# EAGLE board stm32 v0.8 (EAGLE 9.6.1), part 1 of 2
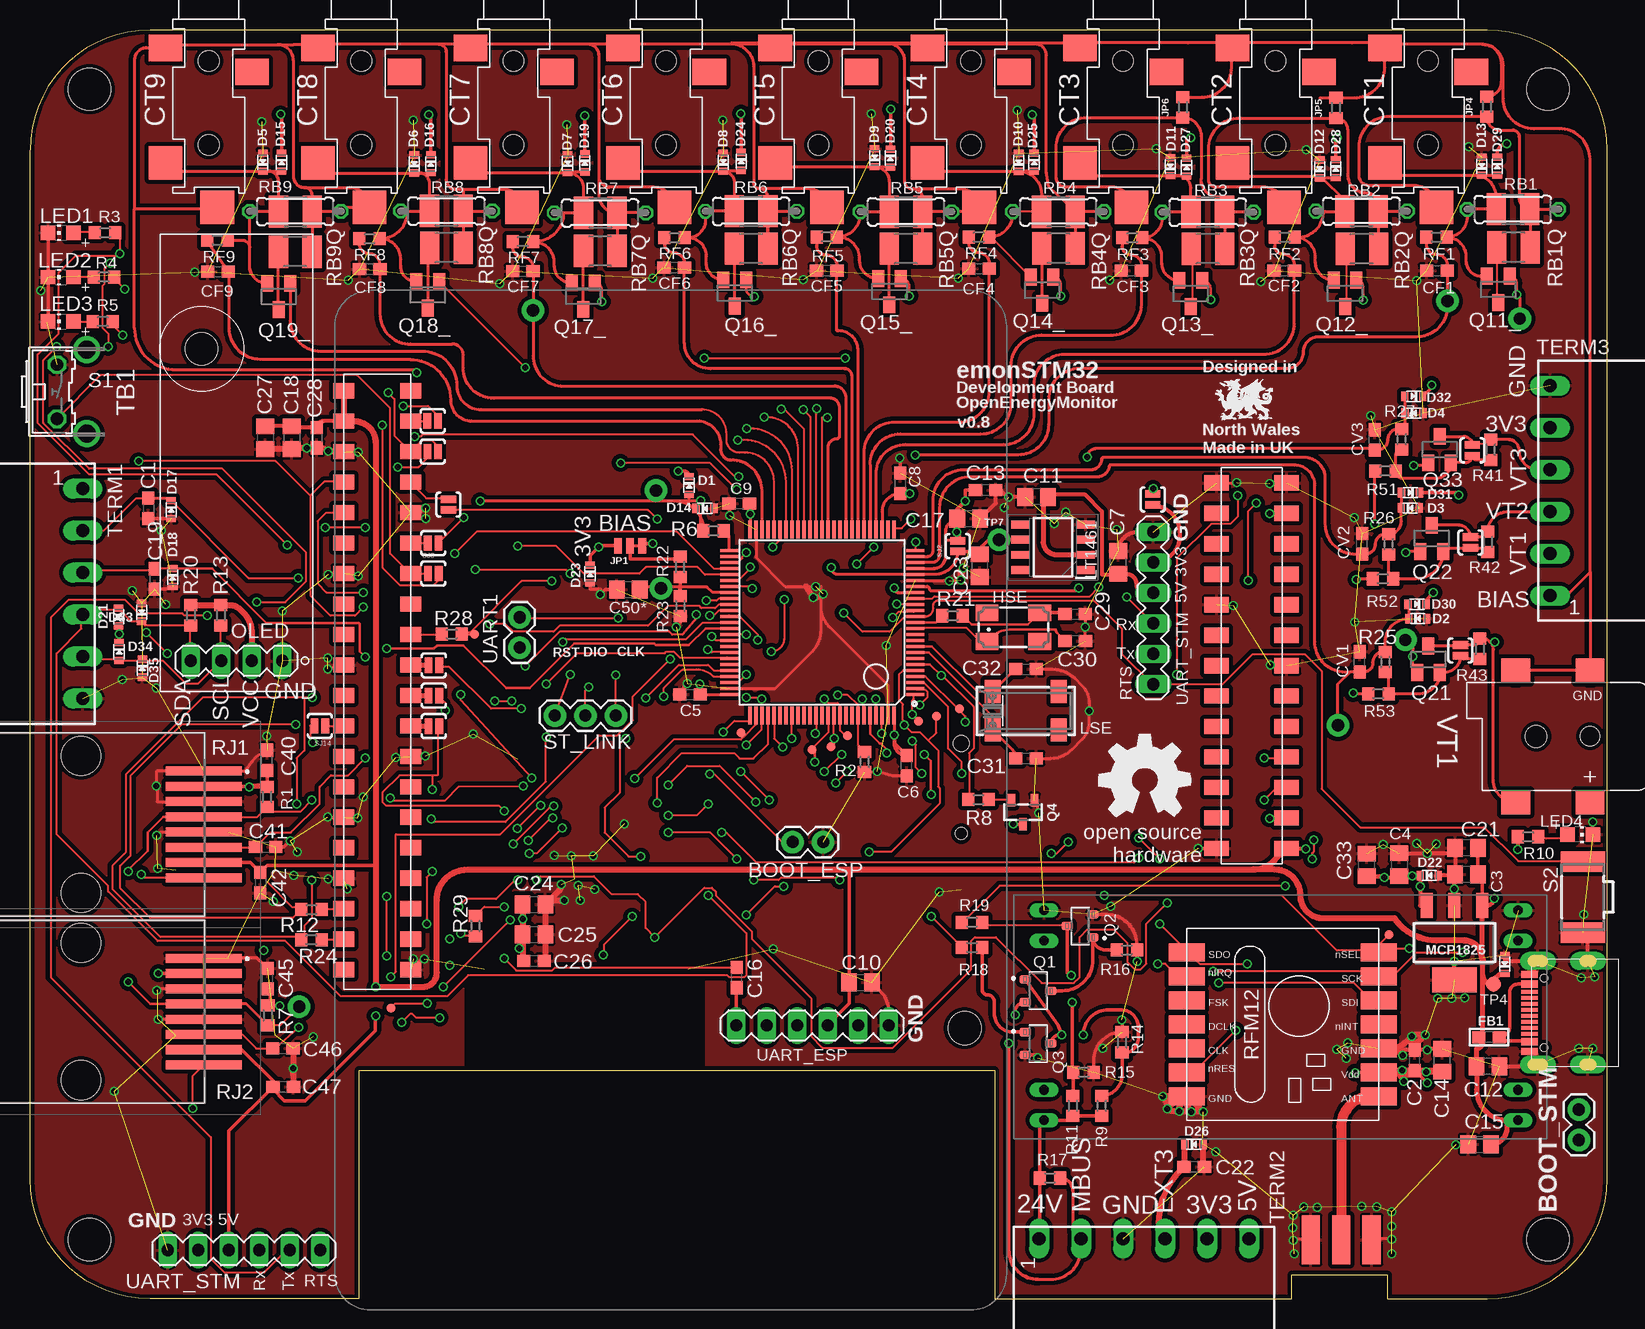
[diagram p5: board, top side]
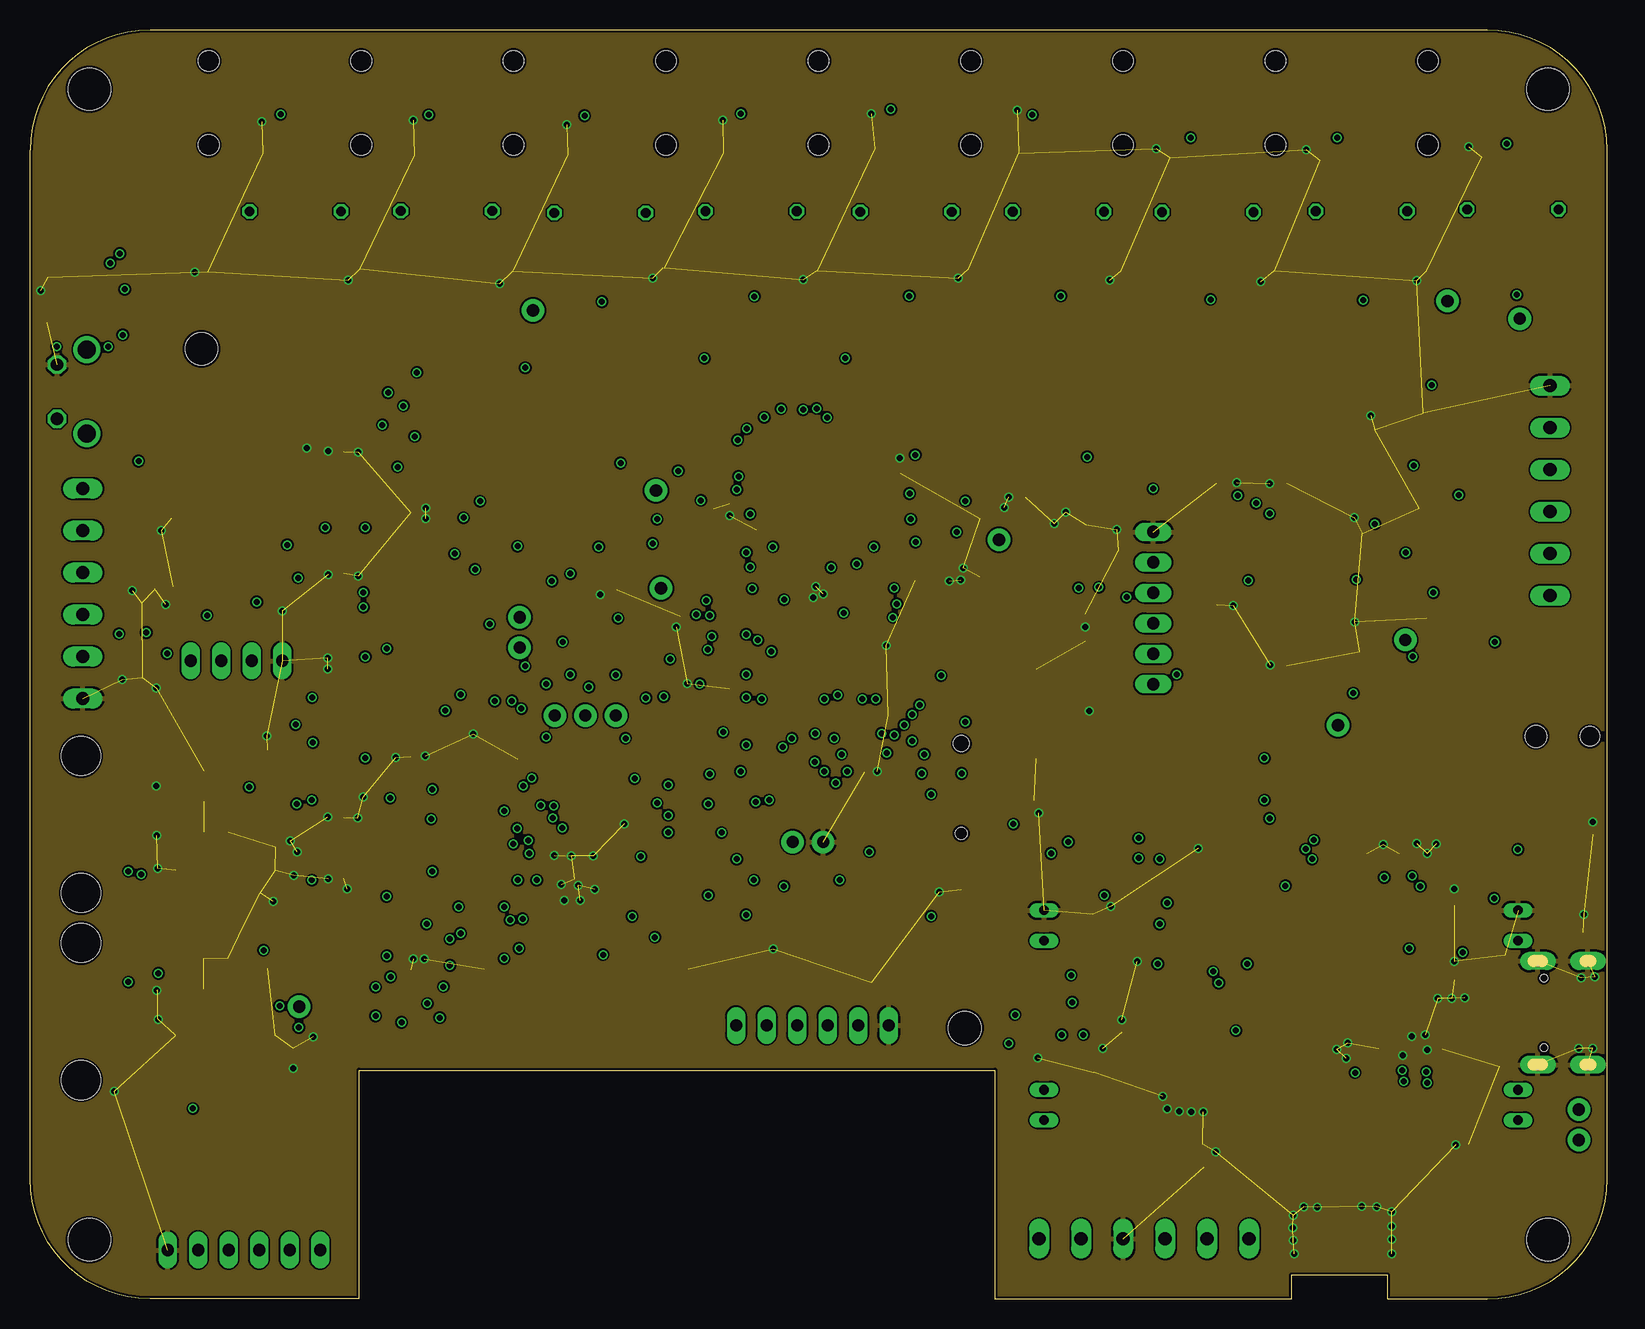
[diagram p6: board, inner layer GND]
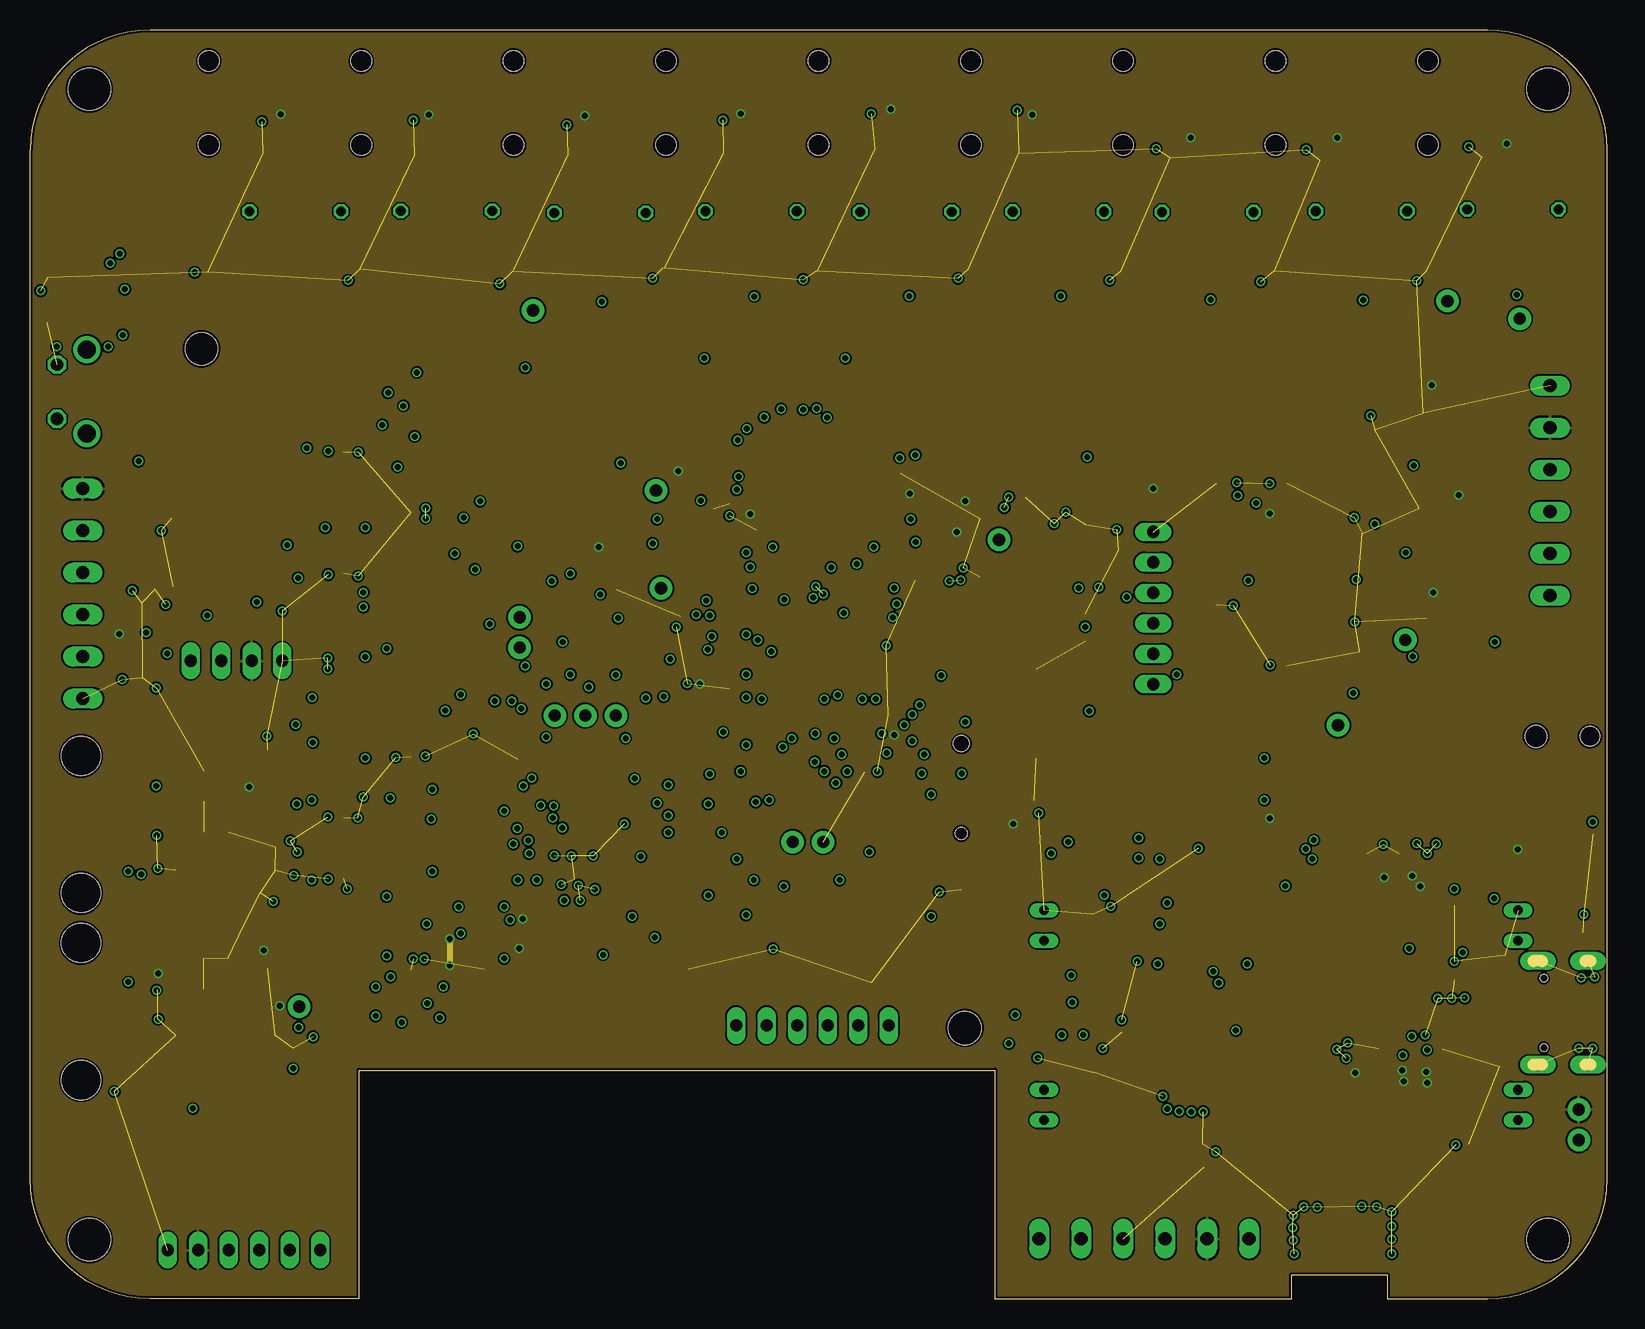
[diagram p7: board, inner layer +3V3]
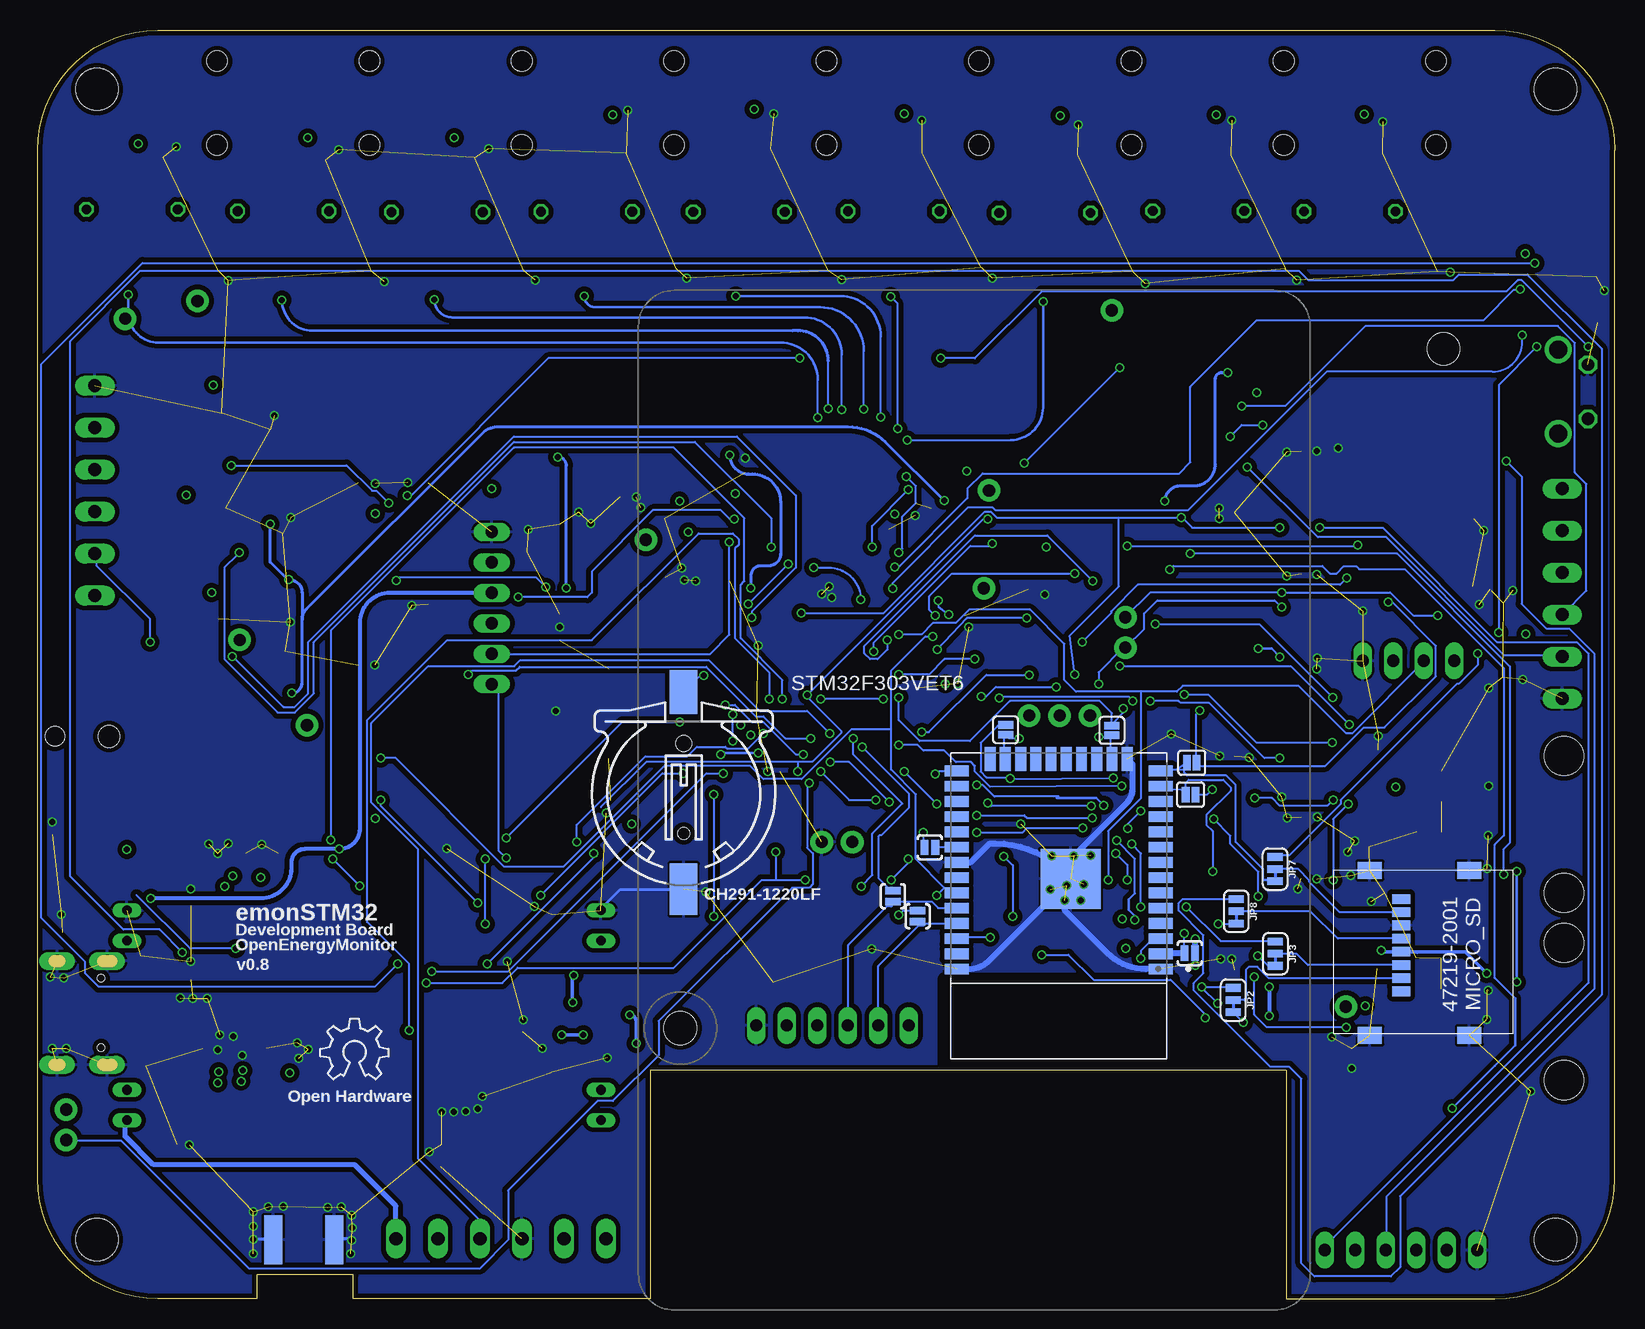
[diagram p8: board, bottom side, seen from below]

Size 131.44 x 105.79 mm. Coordinates in mm from the lower left corner, seen from the top.
Outline: 131.44,10 131.44,95.79 arc90 121.44,105.79 10,105.79 arc90 0,95.79 0,10 arc90 10,0 27.4,0 27.4,19.07 80.41,19.07 80.41,0 105.14,0 105.14,2 113.14,2 113.14,0 121.44,0 arc90 131.44,10
Copper layers (1+2*15+16): Top 0.035mm / dielectric 0.2mm / GND 0.018mm / dielectric 1.1mm / +3V3 0.018mm / dielectric 0.2mm / Bottom 0.035mm
Design rules "ragworm *": minimum track width 7mil, minimum drill 0.5mm, track to track 6mil, track to pad 6mil, pad to pad 7mil, via to via 8mil, smd to smd 0mil, copper to edge 8mil, drill to drill 10mil, minimum pad ring 3mil, minimum via ring 3mil, stop-mask expansion 2mil, vias tented up to drill 25mil, thermal gap 8mil
Net classes: 0 default: width 0.178 mm, drill 0.5 mm, clearance 0.152 mm; 1 power: width 0.254 mm, drill 0.5 mm, clearance 0.152 mm; 2 gnd: width 0.254 mm, drill 0.5 mm, clearance 0.152 mm; 3 ant: width 0.406 mm, drill 0.5 mm, clearance 0.254 mm; 4 cts_vts: width 0.254 mm, drill 0.5 mm, clearance 0.229 mm
Holes 3.5 mm at 126.5,100.85 4.95,100.85 4.95,4.95 126.5,4.95
Holes 2.7 mm at 14.3,79.2
tRestrict: area 36.6,18.4 to 55.9,26.8
bRestrict: area 36.7,18.4 to 56,26.8

## Footprints (pad centres in the part's own frame; a part is rotated, then mirrored left to right if it is on the bottom)
1X02 = drill 1.016 pad 1.88: 1 0,0; 2 2.54,0
C0603 = smd 1.1 x 1: 1 -0.85,0; 2 0.85,0
C0805 = smd 1.3 x 1.5: 1 -0.95,0; 2 0.95,0
STEREO_SMT = smd 2.8 x 2.2: P$1 -3.6,-2.4; P$3 3.6,-4.4 | smd 2.8 x 2.8: P$2 -3.6,-12; P$4 0.7,-15.7 | hole 1.7: 0,-3.5; 0,-10.5
SOD-523 = smd 0.8 x 0.6: A 0,-0.75; K 0,0.75
2X13_SMT = smd 1.27 x 2.032: 1 -15.24,-2.921; 2 -15.24,2.921; 3 -12.7,-2.921; 4 -12.7,2.921; 5 -10.16,-2.921; 6 -10.16,2.921; 7 -7.62,-2.921; 8 -7.62,2.921; 9 -5.08,-2.921; 10 -5.08,2.921; 11 -2.54,-2.921; 12 -2.54,2.921; 13 0,-2.921; 14 0,2.921; 15 2.54,-2.921; 16 2.54,2.921; 17 5.08,-2.921; 18 5.08,2.921; 19 7.62,-2.921; 20 7.62,2.921; 21 10.16,-2.921; 22 10.16,2.921; 23 12.7,-2.921; 24 12.7,2.921; 25 15.24,-2.921; 26 15.24,2.921
0603 = smd 1.1 x 1: 1 -0.85,0; 2 0.85,0
CH291-1220LF = smd 2.3 x 3.66: + 0,-2.296 | smd 2.3 x 4.3: - 0,14.146 | hole 1.3: 0,2 | hole 1: 0,9.5
CTS406 = smd 1.9 x 1.4: 1 -2.2,-1.2; 2 2.2,-1.2; 3 2.2,1.2; 4 -2.2,1.2
SJ_2S-NO = smd 0.635 x 1.27: 1 -0.45,0; 2 0.45,0
SMA-EDGE = smd 1.524 x 4.064: GND@0 0,0; GND@1 5.08,0; SIG 2.54,0 | smd 1.524 x 4.064 bottom: GND@2 0,0; GND@3 5.08,0
SMT-JUMPER_3_1-NC_TRACE_NO-SILK = smd 0.635 x 1.27: 1 -1.016,0; 2 0,0; 3 1.016,0
SMT-JUMPER_3_1-NC_TRACE_SILK = smd 0.635 x 1.27: 1 -1.016,0; 2 0,0; 3 1.016,0
R0603 = smd 1 x 1.1: 1 -0.85,0; 2 0.85,0
CHIP-LED0805 = smd 1.2 x 1.2: A 0,-1.05; C 0,1.05
CRYSTAL_8X3.8 = smd 1.3 x 1.9: P$1 -2.75,-1.6; P$2 2.75,-1.6; P$3 2.75,1.6; P$4 -2.75,1.6
SOT-223 = smd 1 x 2.1: 1 -2.3,-3.1; 2 0,-3.1; 3 2.3,-3.1 | smd 3.7 x 2.1: 4 0,3.1
MA04-1-OLED = drill 1.016 long: 1 -3.81,0; 2 -1.27,0; 3 1.27,0; 4 3.81,0
RPI3MIRROR2 = smd 1.27 x 1.778: P$41 8.371,6.351; P$42 8.371,0.763; P$43 10.911,6.351; P$44 10.911,0.763; P$45 13.451,6.351; P$46 13.451,0.763; P$47 15.991,6.351; P$48 15.991,0.763; P$49 18.531,6.351; P$50 18.531,0.763; P$51 21.071,6.351; P$52 21.071,0.763; P$53 23.611,6.351; P$54 23.611,0.763; P$55 26.151,6.351; P$56 26.151,0.763; P$57 28.691,6.351; P$58 28.691,0.763; P$59 31.231,6.351; P$60 31.231,0.763; P$61 33.771,6.351; P$62 33.771,0.763; P$63 36.311,6.351; P$64 36.311,0.763; P$65 38.851,6.351; P$66 38.851,0.763; P$67 41.391,6.351; P$68 41.391,0.763; P$69 43.931,6.351; P$70 43.931,0.763; P$71 46.471,6.351; P$72 46.471,0.763; P$73 49.011,6.351; P$74 49.011,0.763; P$75 51.551,6.351; P$76 51.551,0.763; P$77 54.091,6.351; P$78 54.091,0.763; P$79 56.631,6.351; P$80 56.631,0.763 | hole 2.75: 61.5,52.505
SOIC127P599X175-8N = smd 1.526 x 0.65: 1 -2.712,1.905; 2 -2.712,0.635; 3 -2.712,-0.635; 4 -2.712,-1.905; 5 2.712,-1.905; 6 2.712,-0.635; 7 2.712,0.635; 8 2.712,1.905
SOT23 = smd 0.71 x 0.96: 1 -0.95,-1.075; 2 0.95,-1.075; 3 0,1.075
SOT23-R = smd 0.635 x 1.016: 1 -0.95,-1; 2 0.95,-1; 3 0,1
SOT23' = smd 1 x 1.4: 1 -0.95,-1.1; 2 0.95,-1.1; 3 0,1.1
R1210 = smd 1.6 x 2.7: 1 -1.4,0; 2 1.4,0
0207/7 = drill 0.813 octagon: 1 -3.81,0; 2 3.81,0
RFM12 = smd 1.5 x 3: 1 -5,-10; 2 -3,-10; 3 -1,-10; 4 1,-10; 5 3,-10; 6 5,-10; 7 7,-10; 8 7,6; 9 5,6; 10 3,6; 11 1,6; 12 -1,6; 13 -3,6; 14 -5,6
955016889 = smd 0.76 x 6.35: 1 -4.445,8.975; 2 -3.175,8.975; 3 -1.905,8.975; 4 -0.635,8.975; 5 0.635,8.975; 6 1.905,8.975; 7 3.175,8.975; 8 4.445,8.975 | hole 3.25: -5.715,-1.25; 5.715,-1.25
B3F-31XX = drill 1.016 octagon: 1 -2.261,-1.245; 2 2.261,-1.245 | drill 1.499 pad 2.159: 3 -3.505,1.245; 4 3.505,1.245
KSS = smd 1.7 x 3.7: 1 -2.95,0; 2 2.95,0
SMT-JUMPER_2_NO_SILK = smd 0.635 x 1.27: 1 -0.406,0; 2 0.406,0
1X03 = drill 1.016 pad 1.88: 1 0,0; 2 2.54,0; 3 5.08,0
TQFP100 = smd 0.27 x 1.5: 1 -6,-7.75; 2 -5.5,-7.75; 3 -5,-7.75; 4 -4.5,-7.75; 5 -4,-7.75; 6 -3.5,-7.75; 7 -3,-7.75; 8 -2.5,-7.75; 9 -2,-7.75; 10 -1.5,-7.75; 11 -1,-7.75; 12 -0.5,-7.75; 13 0,-7.75; 14 0.5,-7.75; 15 1,-7.75; 16 1.5,-7.75; 17 2,-7.75; 18 2.5,-7.75; 19 3,-7.75; 20 3.5,-7.75; 21 4,-7.75; 22 4.5,-7.75; 23 5,-7.75; 24 5.5,-7.75; 25 6,-7.75; 51 6,7.75; 52 5.5,7.75; 53 5,7.75; 54 4.5,7.75; 55 4,7.75; 56 3.5,7.75; 57 3,7.75; 58 2.5,7.75; 59 2,7.75; 60 1.5,7.75; 61 1,7.75; 62 0.5,7.75; 63 0,7.75; 64 -0.5,7.75; 65 -1,7.75; 66 -1.5,7.75; 67 -2,7.75; 68 -2.5,7.75; 69 -3,7.75; 70 -3.5,7.75; 71 -4,7.75; 72 -4.5,7.75; 73 -5,7.75; 74 -5.5,7.75; 75 -6,7.75 | smd 1.5 x 0.27: 26 7.75,-6; 27 7.75,-5.5; 28 7.75,-5; 29 7.75,-4.5; 30 7.75,-4; 31 7.75,-3.5; 32 7.75,-3; 33 7.75,-2.5; 34 7.75,-2; 35 7.75,-1.5; 36 7.75,-1; 37 7.75,-0.5; 38 7.75,0; 39 7.75,0.5; 40 7.75,1; 41 7.75,1.5; 42 7.75,2; 43 7.75,2.5; 44 7.75,3; 45 7.75,3.5; 46 7.75,4; 47 7.75,4.5; 48 7.75,5; 49 7.75,5.5; 50 7.75,6; 76 -7.75,6; 77 -7.75,5.5; 78 -7.75,5; 79 -7.75,4.5; 80 -7.75,4; 81 -7.75,3.5; 82 -7.75,3; 83 -7.75,2.5; 84 -7.75,2; 85 -7.75,1.5; 86 -7.75,1; 87 -7.75,0.5; 88 -7.75,0; 89 -7.75,-0.5; 90 -7.75,-1; 91 -7.75,-1.5; 92 -7.75,-2; 93 -7.75,-2.5; 94 -7.75,-3; 95 -7.75,-3.5; 96 -7.75,-4; 97 -7.75,-4.5; 98 -7.75,-5; 99 -7.75,-5.5; 100 -7.75,-6
MA06-1 = drill 1.016 long: 1 -6.35,0; 2 -3.81,0; 3 -1.27,0; 4 1.27,0; 5 3.81,0; 6 6.35,0
3.5MM_X6 = drill 1.1 long: P$1 3,8.75; P$2 3,5.25; P$3 3,1.75; P$4 3,-1.75; P$5 3,-5.25; P$6 3,-8.75
PAD.03X.03 = smd 0.762 x 0.762: P$1 0,0
B1,27 = smd 1.27 x 1.27: TP 0,0
1X01_NO_SILK = drill 1.016 pad 1.88: 1 0,0
MODULE_ESP32-WROOM-32D = smd 2 x 0.9: 1 -8.5,5.26; 2 -8.5,3.99; 3 -8.5,2.72; 4 -8.5,1.45; 5 -8.5,0.18; 6 -8.5,-1.09; 7 -8.5,-2.36; 8 -8.5,-3.63; 9 -8.5,-4.9; 10 -8.5,-6.17; 11 -8.5,-7.44; 12 -8.5,-8.71; 13 -8.5,-9.98; 14 -8.5,-11.25; 25 8.5,-11.25; 26 8.5,-9.98; 27 8.5,-8.71; 28 8.5,-7.44; 29 8.5,-6.17; 30 8.5,-4.9; 31 8.5,-3.63; 32 8.5,-2.36; 33 8.5,-1.09; 34 8.5,0.18; 35 8.5,1.45; 36 8.5,2.72; 37 8.5,3.99; 38 8.5,5.26 | smd 0.9 x 2: 15 -5.715,-12.25; 16 -4.445,-12.25; 17 -3.175,-12.25; 18 -1.905,-12.25; 19 -0.635,-12.25; 20 0.635,-12.25; 21 1.905,-12.25; 22 3.175,-12.25; 23 4.445,-12.25; 24 5.715,-12.25 | smd 5 x 5: 39 -1,-2.24
BOOST = drill 0.8 long: IN+ 17.5,39.5; IN+1 14.96,39.5; OUT+ 17.5,0; OUT+1 14.96,0; P$1 0,0; P$2 0,39.5; P$3 2.54,39.5; P$4 2.54,0
47219-2001_MICROSD = smd 1.45 x 2: P$1 0,0; P$2 13.75,0; P$3 0,8.3; P$4 13.75,8.3 | smd 0.8 x 1.5: PIN1 10.08,2.6; PIN2 8.98,2.6; PIN3 7.88,2.6; PIN4 6.78,2.6; PIN5 5.68,2.6; PIN6 4.58,2.6; PIN7 3.48,2.6; PIN8 2.38,2.6
USB-C = smd 0.6 x 1.4: A1/B12 -3.2,0.7; A4/B9 -2.4,0.7; B1/A12 3.2,0.7; B4/A9 2.4,0.7 | smd 0.3 x 1.4: A5 -1.25,0.7; A6 -0.25,0.7; A7 0.25,0.7; A8 1.25,0.7; B5 1.75,0.7; B6 0.75,0.7; B7 -0.75,0.7; B8 -1.75,0.7 | drill 1 pad 1.2 long: GND1 -4.32,0; GND2 4.33,0; GND3 4.33,-4.18; GND4 -4.32,-4.18 | hole 0.6: -2.89,-0.5; 2.89,-0.5
DCJACK_2MM_SMT = smd 2.4 x 2: GND 0,-5.5; GNDBREAK 6.2,-5.5; PWR1 0,5.5; PWR2 6.2,5.5 | hole 1.6: 0,0 | hole 1.8: 4.5,0

## Placement (x,y rotation side)
BOOT_ESP  [1X02]  66.1,38.1 180 top
BOOT_STM  [1X02]  129.07,13.25 90 top
C1  100nF  [C0603]  9.87,65.91 270 top
C2  100nF  [C0603]  115.4,19.9 90 top
C3  2.2uF  [C0805]  119.7,35.4 180 top
C4  2.2uF  [C0805]  114.1,36.2 270 top
C5  100nF  [C0603]  55,50.4 0 top
C6  100nF  [C0603]  73.05,44.46 90 top
C7  2.2uF  [C0805]  90.7,61.4 90 top
C8  100nF  [C0603]  72.5,68 270 top
C9  100nF  [C0603]  59.1,66.33 0 top
C10  2.2uF  [C0805]  69.2,26.4 0 top
C11  2.2uF  [C0805]  83.89,66.87 180 top
C12  47uF  [C0805]  121.5,19.4 180 top
C13  100nF  [C0603]  79.63,67.45 0 top
C14  2.2uF  [C0805]  117.7,19.9 90 top
C15  2.2uF  [C0805]  120.8,12.9 0 top
C16  100nF  [C0603]  58.9,26.8 90 top
C17  2.2uF  [C0805]  78.22,65.06 0 top
C18  2.2uF  [C0805]  21.8,71.8 270 top
C19  100nF  [C0603]  10.41,60.03 270 top
C21  47uF  [C0805]  119.7,37.6 180 top
C22  100nF  [C0603]  97.02,11.03 0 top
C23  2.2uF  [C0805]  79.13,61.14 270 top
C24  2.2uF  [C0805]  42,32.9 0 top
C25  2.2uF  [C0805]  42,30.4 0 top
C26  100nF  [C0603]  42,28.2 0 top
C27  2.2uF  [C0805]  19.6,71.8 270 top
C28  100nF  [C0603]  23.9,71.8 270 top
C29  15pF  [C0603]  87.09,57.09 0 top
C30  15pF  [C0603]  87.1,54.86 0 top
C31  10pF  [C0603]  83,45.08 0 top
C32  10pF  [C0603]  83,52.5 0 top
C33  47uF  [C0805]  111.4,36.19 90 top
C40  100nF  [C0603]  19.75,44.9 90 top
C41  100nF  [C0603]  19.64,37.67 0 top
C42  100nF  [C0603]  19.2,34.7 270 top
C45  100nF  [C0603]  19.8,26.7 90 top
C46  100nF  [C0603]  21.07,20.89 0 top
C47  100nF  [C0603]  21.1,17.7 0 top
C50*  2.2uF  [C0805]  49.86,59.16 0 top
CF1  10nF  [C0603]  117.25,85.72 0 top
CF2  10nF  [C0603]  104.52,85.73 0 top
CF3  10nF  [C0603]  91.78,85.75 0 top
CF4  10nF  [C0603]  79.09,85.88 0 top
CF5  10nF  [C0603]  66.4,85.74 0 top
CF6  10nF  [C0603]  53.68,85.99 0 top
CF7  10nF  [C0603]  41.07,85.67 0 top
CF8  10nF  [C0603]  28.31,85.86 0 top
CF9  10nF  [C0603]  15.67,85.64 0 top
CT1  SJ-3523-SMT  [STEREO_SMT]  116.5,106.7 0 top
CT2  SJ-3523-SMT  [STEREO_SMT]  103.8,106.7 0 top
CT3  SJ-3523-SMT  [STEREO_SMT]  91.1,106.7 0 top
CT4  SJ-3523-SMT  [STEREO_SMT]  78.4,106.7 0 top
CT5  SJ-3523-SMT  [STEREO_SMT]  65.7,106.7 0 top
CT6  SJ-3523-SMT  [STEREO_SMT]  53,106.7 0 top
CT7  SJ-3523-SMT  [STEREO_SMT]  40.3,106.7 0 top
CT8  SJ-3523-SMT  [STEREO_SMT]  27.6,106.7 0 top
CT9  SJ-3523-SMT  [STEREO_SMT]  14.9,106.7 0 top
CV1  10nF  [C0603]  110.8,53.12 90 top
CV2  10nF  [C0603]  111,62.95 90 top
CV3  10nF  [C0603]  112.05,71.61 90 top
D1  ESD5Z3.3T1G  [SOD-523]  54.92,67.82 0 top
D2  ESD5Z3.3T1G  [SOD-523]  115.65,56.72 90 top
D3  ESD5Z3.3T1G  [SOD-523]  115.02,65.94 90 top
D4  ESD5Z3.3T1G  [SOD-523]  115.34,73.85 90 top
D5  ESD5Z3.3T1G  [SOD-523]  19.41,94.77 180 top
D6  ESD5Z3.3T1G  [SOD-523]  32.02,94.62 180 top
D7  ESD5Z3.3T1G  [SOD-523]  44.79,94.66 180 top
D8  ESD5Z3.3T1G  [SOD-523]  57.76,94.76 180 top
D9  ESD5Z3.3T1G  [SOD-523]  70.39,95.14 180 top
D10  ESD5Z3.3T1G  [SOD-523]  82.39,94.76 180 top
D11  ESD5Z3.3T1G  [SOD-523]  95.03,94.39 180 top
D12  ESD5Z3.3T1G  [SOD-523]  107.48,94.21 180 top
D13  ESD5Z3.3T1G  [SOD-523]  120.98,94.42 180 top
D14  ESD5Z3.3T1G  [SOD-523]  56.25,65.91 90 top
D15  ESD5Z3.3T1G  [SOD-523]  20.96,94.76 0 top
D16  ESD5Z3.3T1G  [SOD-523]  33.4,94.64 0 top
D17  ESD5Z3.3T1G  [SOD-523]  11.76,65.8 0 top
D18  ESD5Z3.3T1G  [SOD-523]  11.9,60.15 0 top
D19  ESD5Z3.3T1G  [SOD-523]  46.24,94.71 0 top
D20  ESD5Z3.3T1G  [SOD-523]  71.7,95.11 0 top
D21  ESD5Z3.3T1G  [SOD-523]  7.38,56.87 180 top
D22  ESD5Z3.3T1G  [SOD-523]  116.6,35.3 90 top
D23  ESD5Z3.3T1G  [SOD-523]  46.67,60.45 0 top
D24  ESD5Z3.3T1G  [SOD-523]  59.26,94.83 0 top
D25  ESD5Z3.3T1G  [SOD-523]  83.67,94.76 0 top
D26  ESD5Z3.3T1G  [SOD-523]  97,12.88 90 top
D27  ESD5Z3.3T1G  [SOD-523]  96.38,94.35 0 top
D28  ESD5Z3.3T1G  [SOD-523]  108.81,94.23 0 top
D29  ESD5Z3.3T1G  [SOD-523]  122.27,94.43 0 top
D30  ESD5Z3.3T1G  [SOD-523]  115.59,57.92 270 top
D31  ESD5Z3.3T1G  [SOD-523]  115.04,67.23 270 top
D32  ESD5Z3.3T1G  [SOD-523]  115.32,75.25 270 top
D33  ESD5Z3.3T1G  [SOD-523]  9.3,57.26 180 top
D34  ESD5Z3.3T1G  [SOD-523]  7.42,53.97 0 top
D35  ESD5Z3.3T1G  [SOD-523]  9.37,52.58 0 top
D40*1  ESD5Z5.0T1G  [SOD-523]  122.9,27.9 180 top
EXPANSION  TSM-113-01-T-DV  [2X13_SMT]  101.8,52.8 270 top
FB1  [0603]  121.58,21.83 180 top
G1  CH291-1220LF  [CH291-1220LF]  77.61,48.3 180 bottom
GOLD_ORB_SM1  OSHWLOGOLOGO8MM  [OSHW_8MM]  92.87,43.24 0 top
HSE  406C35E08M00000  [CTS406]  81.95,56.01 0 top
J1  SOLDERJUMPERNO  [SJ_2S-NO]  34.87,66.23 90 top
J$1  SMA_EDGE  [SMA-EDGE]  106.72,4.93 0 top
JP1  JUMPER-SMT_3_1-NC_TRACE_NO-SILK  [SMT-JUMPER_3_1-NC_TRACE_NO-SILK]  50,62.8 0 top
JP2  JUMPER-SMT_3_1-NC_TRACE_SILK  [SMT-JUMPER_3_1-NC_TRACE_SILK]  31.82,24.92 270 bottom
JP3  JUMPER-SMT_3_1-NC_TRACE_SILK  [SMT-JUMPER_3_1-NC_TRACE_SILK]  28.3,28.78 270 bottom
JP4  [R0603]  121.4,99.4 90 top
JP5  [R0603]  108.83,99.3 90 top
JP6  [R0603]  96.07,99.34 90 top
JP7  JUMPER-SMT_3_1-NC_TRACE_SILK  [SMT-JUMPER_3_1-NC_TRACE_SILK]  28.32,35.84 270 bottom
JP8  JUMPER-SMT_3_1-NC_TRACE_SILK  [SMT-JUMPER_3_1-NC_TRACE_SILK]  31.56,32.32 270 bottom
LED1  Green 1.85V  [CHIP-LED0805]  2.56,88.89 90 top
LED2  Orange 1.85V  [CHIP-LED0805]  2.56,85.19 90 top
LED3  Red 1.85V  [CHIP-LED0805]  2.56,81.49 90 top
LED4  Green 1.85V  [CHIP-LED0805]  129.19,38.71 270 top
LOGO1  OSHW_LOGO_6MILX0200-NT  [OSHW_6X200_NOTEXT]  107.87,18.31 0 bottom
LSE  32.768kHz  [CRYSTAL_8X3.8]  82.98,49.04 0 top
MCP1825  MCP1825SOT-223-3  [SOT-223]  118.7,29.7 180 top
OLED  [MA04-1-OLED]  17.2,53.2 0 top
PCB2  RPI3YA  [RPI3MIRROR2]  25.38,84.09 270 top
PS1  LT1461AIS8-3.3#PBF  [SOIC127P599X175-8N]  85.25,62.67 180 top
Q1  MMBT3906  [SOT23]  84,25.7 270 top
Q2  MMBT3904  [SOT23]  87.5,31.1 90 top
Q3  MMBT3904  [SOT23]  84,21.3 270 top
Q4  [SOT23-R]  82.75,40.58 180 top
Q11_  [SOT23']  122.35,84.17 180 top
Q12_  [SOT23']  109.59,83.83 180 top
Q13_  [SOT23']  96.72,83.82 180 top
Q14_  [SOT23']  84.34,84.1 180 top
Q15_  [SOT23']  71.62,83.97 180 top
Q16_  [SOT23']  58.73,83.86 180 top
Q17_  [SOT23']  46.1,83.6 180 top
Q18_  [SOT23']  33.15,83.71 180 top
Q19_  [SOT23']  20.72,83.57 180 top
Q21  [SOT23']  116.54,53.32 0 top
Q22  [SOT23']  116.81,63.4 0 top
Q33  [SOT23']  117.47,70.81 0 top
R1  4.7k  [R0603]  19.75,41.85 90 top
R2  10k  [R0603]  69.55,44.77 270 top
R3  330R  [R0603]  6.26,88.89 0 top
R4  330R  [R0603]  6.16,85.19 0 top
R5  330R  [R0603]  6.06,81.49 0 top
R6  0R  [R0603]  56.96,64.05 0 top
R7  4.7k  [R0603]  19.83,23.65 90 top
R8  1.5k  [R0603]  79.04,41.64 180 top
R9  39K  [R0603]  89.3,16.1 270 top
R10  330R  [R0603]  124.84,38.54 180 top
R11  33K  [R0603]  86.9,16.1 270 top
R12  10K  [R0603]  23.46,32.48 180 top
R13  10k  [R0603]  15.9,57 270 top
R14  22K  [R0603]  91,21.4 270 top
R15  3k3  [R0603]  87.8,18.9 180 top
R16  82R  [R0603]  91.4,29.1 180 top
R17  220K  [R0603]  85,10.08 180 top
R18  1k  [R0603]  78.5,29.3 180 top
R19  1k  [R0603]  78.5,31.4 180 top
R20  10k  [R0603]  13.4,57 270 top
R21  0R  [R0603]  76.88,56.96 0 top
R22  10k  [R0603]  54.18,61.03 90 top
R23  10k  [R0603]  54.2,57.77 90 top
R24  10K  [R0603]  23.45,29.95 180 top
R25  1k  [R0603]  112.95,53.1 90 top
R26  1k  [R0603]  113.22,62.92 90 top
R27  1k  [R0603]  114.31,71.66 90 top
R28  10K  [R0603]  35.15,55.43 180 top
R29  10K  [R0603]  37.12,31.1 90 top
R41  120k  [R0603]  121.72,70.8 270 top
R42  120k  [R0603]  121.49,63.13 90 top
R43  120k  [R0603]  120.82,54.2 90 top
R51  10k  [R0603]  112.94,69.03 180 top
R52  10k  [R0603]  112.74,60.04 180 top
R53  10k  [R0603]  112.37,50.44 180 top
RB1  22r 0.3W 1%  [R1210]  123.58,90.85 0 top
RB1_  22r 0.5W  [0207/7]  123.57,90.84 0 top
RB1Q  22r  [R1210]  123.63,87.67 180 top
RB2  22r  [R1210]  110.96,90.66 0 top
RB2_  22r  [0207/7]  110.96,90.69 0 top
RB2Q  22r  [R1210]  111,87.54 180 top
RB3  22r  [R1210]  98.15,90.61 0 top
RB3_  22r  [0207/7]  98.15,90.61 0 top
RB3Q  22r  [R1210]  98.17,87.55 180 top
RB4  22r  [R1210]  85.7,90.64 0 top
RB4_  22r  [0207/7]  85.7,90.64 0 top
RB4Q  22r  [R1210]  85.72,87.58 180 top
RB5  22r  [R1210]  73,90.64 0 top
RB5_  22r  [0207/7]  73,90.63 0 top
RB5Q  22r  [R1210]  72.99,87.57 180 top
RB6  22r  [R1210]  60.1,90.69 0 top
RB6_  22r  [0207/7]  60.1,90.68 0 top
RB6Q  22r  [R1210]  60.09,87.56 180 top
RB7  22r  [R1210]  47.52,90.54 0 top
RB7_  22r  [0207/7]  47.51,90.54 0 top
RB7Q  22r  [R1210]  47.52,87.36 180 top
RB8  22r  [R1210]  34.7,90.71 0 top
RB8_  22r  [0207/7]  34.71,90.7 0 top
RB8Q  22r  [R1210]  34.71,87.64 180 top
RB9  100R 0.1%  [R1210]  22.11,90.64 0 top
RB9_  100R 0.1%  [0207/7]  22.11,90.67 0 top
RB9Q  22R 0.1%  [R1210]  22.1,87.3 180 top
RF1  9k1 0.1%  [R0603]  117.21,88.51 180 top
RF2  9k1 0.1%  [R0603]  104.57,88.52 180 top
RF3  9k1 0.1%  [R0603]  91.85,88.47 180 top
RF4  9k1 0.1%  [R0603]  79.07,88.52 180 top
RF5  9k1 0.1%  [R0603]  66.39,88.53 180 top
RF6  9k1 0.1%  [R0603]  53.71,88.47 180 top
RF7  9k1 0.1%  [R0603]  41.07,88.15 180 top
RF8  9k1 0.1%  [R0603]  28.29,88.39 180 top
RF9  9k1 0.1%  [R0603]  15.63,88.26 180 top
RFM69HCW  RFM12_SMDSMD  [RFM12]  106.4,23.9 270 top
RJ1  95501-6889  [955016889]  5.5,39.56 270 top
RJ2  95501-6889  [955016889]  5.5,23.96 270 top
S1  [B3F-31XX]  3.5,75.64 270 top
S2  KSS221GLFS  [KSS]  129.4,33.5 90 top
SJ1  SOLDERJUMPERNO  [SJ_2S-NO]  93.57,66.66 90 top
SJ2  SOLDERJUMPERNO  [SJ_2S-NO]  77.31,62.77 90 top
SJ3  SOLDERJUMPERNO  [SJ_2S-NO]  33.61,60.48 0 top
SJ4  JUMPER-SMT_2_NO_SILK  [SMT-JUMPER_2_NO_SILK]  35.26,44.71 0 bottom
SJ5  SOLDERJUMPERNO  [SJ_2S-NO]  33.66,52.83 180 top
SJ6  SOLDERJUMPERNO  [SJ_2S-NO]  33.66,50.29 180 top
SJ7  SOLDERJUMPERNO  [SJ_2S-NO]  33.66,47.75 180 top
SJ9  JUMPER-SMT_2_NO_SILK  [SMT-JUMPER_2_NO_SILK]  41.93,47.4 90 bottom
SJ10  JUMPER-SMT_2_NO_SILK  [SMT-JUMPER_2_NO_SILK]  35.36,42.05 0 bottom
SJ13  JUMPER-SMT_2_NO_SILK  [SMT-JUMPER_2_NO_SILK]  50.78,47.45 90 bottom
SJ14  SOLDERJUMPERNO  [SJ_2S-NO]  24.16,47.78 180 top
SJ20  SOLDERJUMPERNO  [SJ_2S-NO]  58.11,31.91 270 bottom
SJ21  SOLDERJUMPERNO  [SJ_2S-NO]  60.17,33.58 270 bottom
SJ23  SOLDERJUMPERNO  [SJ_2S-NO]  35.43,28.83 0 bottom
SJ25  SOLDERJUMPERNO  [SJ_2S-NO]  57.09,37.65 180 bottom
SJ26  SOLDERJUMPERNO  [SJ_2S-NO]  33.56,73.2 180 top
SJ27  SOLDERJUMPERNO  [SJ_2S-NO]  33.56,70.65 180 top
SJ32  SOLDERJUMPERNO  [SJ_2S-NO]  33.6,63.01 180 top
SJ35  SOLDERJUMPERNO  [SJ_2S-NO]  120.19,70.75 90 top
SJ36  SOLDERJUMPERNO  [SJ_2S-NO]  120.04,63.07 90 top
SJ37  SOLDERJUMPERNO  [SJ_2S-NO]  119.2,54.07 90 top
ST_LINK  455-1750-1-ND  [1X03]  48.82,48.64 180 top
STM32F303VET6  STM32F303VE  [TQFP100]  66,56.4 90 top
SV1  [MA06-1]  93.6,57.6 270 top
SV2  [MA06-1]  65.2,22.8 180 top
TERM1  3.5MM_TB_X6  [3.5MM_X6]  1.4,58.8 0 top
TERM2  3.5MM_TB_X6  [3.5MM_X6]  92.84,2.03 90 top
TERM3  3.5MM_TB_X6  [3.5MM_X6]  129.67,67.39 180 top
TP1  TEST-POINT3  [PAD.03X.03]  65.18,45.78 0 top
TP2  TEST-POINT3  [PAD.03X.03]  66.76,46.03 0 top
TP3  TEST-POINT3  [PAD.03X.03]  68.11,46.97 0 top
TP4  TPB1,27  [B1,27]  121.96,26.25 0 top
TP5  TEST-POINTPOGO_PTH  [1X01_NO_SILK]  52.17,67.4 0 top
TP6  TEST-POINTPOGO_PTH  [1X01_NO_SILK]  114.61,54.94 0 top
TP7  TEST-POINTPOGO_PTH  [1X01_NO_SILK]  80.76,63.29 0 top
TP9  TEST-POINTPOGO_PTH  [1X01_NO_SILK]  22.43,24.37 0 top
TP10  TEST-POINTPOGO_PTH  [1X01_NO_SILK]  52.59,59.25 0 top
TP11  TEST-POINT3  [PAD.03X.03]  37.06,55.4 0 top
TP12  TEST-POINT3  [PAD.03X.03]  74.03,48.16 0 top
TP13  TEST-POINT3  [PAD.03X.03]  30.09,24.26 0 top
TP14  TEST-POINT3  [PAD.03X.03]  113.26,30.38 0 top
TP15  TEST-POINT3  [PAD.03X.03]  77.47,49.19 0 top
TP16  TEST-POINT3  [PAD.03X.03]  75.53,48.6 0 top
TP17  TEST-POINTPOGO_PTH  [1X01_NO_SILK]  124.15,81.72 0 top
TP18  TEST-POINTPOGO_PTH  [1X01_NO_SILK]  118.12,83.2 0 top
TP19  TEST-POINTPOGO_PTH  [1X01_NO_SILK]  41.92,82.41 0 top
TP20  TEST-POINTPOGO_PTH  [1X01_NO_SILK]  108.99,47.83 0 top
TP21  TEST-POINT3  [PAD.03X.03]  59.26,47.21 0 top
U1  ESP32-WROOM-32D  [MODULE_ESP32-WROOM-32D]  46.35,32.77 180 bottom
U$2  BOOST_MODULE  [BOOST]  84.5,32.4 270 top
U$7  47219-2001_MICROSD  [47219-2001_MICROSD]  20.43,35.73 270 bottom
UART1  [1X02]  40.8,54.3 90 top
UART_STM  [MA06-1]  17.83,4.07 0 top
USB-C  CSP-USC16-TR  [USB-C]  125.65,23.85 90 top
VT1  ADC-028-2-T  [DCJACK_2MM_SMT]  130,46.9 180 top

## Tracks (layer width: path | path; a pad name or v marks a point on that pad's centre or on a via)
+3V3  (via drill 0.5)
  Top 0.254: C5.2 STM32F303VET6.75 | v60,65.44 STM32F303VET6.50 | 72.5,67.14 arc90 71,65.64 STM32F303VET6.28 | C8.2 v73.29,67.15 | STM32F303VET6.100 v72.03,47.02 | STM32F303VET6.22 75.3,60.9 arc90 76.31,61.92 76.31,63.22 76.31,63.98 arc-90 77.27,64.94 C17.1 | SJ2.2 76.32,63.22
  Top 0.305: D23.K 46.67,61.98 v47.39,62.7 47.49,62.8 JP1.1 | C9.2 60,66.33 v60,65.44 | C8.2 72.5,67.14 | Q4.3 81.96,39.58 arc-90 v81.95,39.59 | C13.1 77.95,67.45 v77.95,66.53 | EXPANSION.4 103.3,65.5 v103.3,65.47 | EXPANSION.24 103.3,40.1 v103.3,40.06 | C45.1 20.03,25.62 20.03,24.83 20.42,24.44 v20.81,24.44 19.89,24.44 R7.2 | RJ1.2 18.21,42.74 v18.27,42.67 | v18.27,42.67 18.28,42.7 arc-45 R1.2 C40.1 19.75,42.85 19.57,42.67 v18.27,42.67 | 76.32,63.22 arc90 76.31,63.22 | D1.K arc90 54.46,69.04 v54.02,69.04 | D15.K 20.96,98.68 arc90 v20.89,98.75 | D16.K 33.4,98.54 arc90 v33.23,98.72 | D19.K 46.24,98.62 arc90 v46.22,98.64 | D24.K 59.26,98.81 arc90 v59.24,98.83 | v71.73,99.18 71.73,95.89 arc-90 D20.K | D25.K 83.67,98.58 arc90 v83.53,98.72 | v96.71,96.82 arc90 96.38,96.48 D27.K | v108.94,96.8 arc90 108.81,96.66 D28.K | v123.06,96.31 arc90 122.27,95.52 D29.K | D21.K arc-90 7.42,56.08 v7.42,55.46 D34.K | v10.7,27.15 RJ2.2 | D31.K 118.87,67.23 v119.06,67.03 | D30.K 116.34,58.28 v116.95,58.89 | D32.K 116.79,75.98 v116.79,76.21 | v110.43,18.86 110.47,18.9 RFM69HCW.9 114.11,18.9 114.35,18.66 | 114.35,18.59 114.35,18.3 v114.49,18.16 113.71,18.94 113.71,18.95 | 114.35,18.59 114.35,18.66 | 114.35,18.66 v114.35,19.05 | v116.42,18.03 115.86,18.59 114.35,18.59 | v72.03,47.02 72.02,46.34 arc90 C6.2 72.06,46.3 72.06,46.8 72.03,46.86 arc90 v72.03,47.02
  Top 0.35: v77.95,66.53 77.27,65.85 C17.1 | v93.6,67.54 93.56,67.51 SJ1.2 | v73.29,67.15 arc-90 v73.3,67.14 | C9.2 60,66.28 60,65.84 60,65.84 arc90 v60,65.44 | C5.2 55.85,51.25 arc90 v55.82,51.29 | v112.86,35.15 114.1,35.15 C4.2 v115.17,35.25 115.85,35.25 D22.K v115.85,34.4 | 115.85,34.19 115.85,32.8 MCP1825.3 | R10.2 v123.99,37.48 v124,37.48
  Top 0.406: v112.86,35.15 112.83,35.17 C33.1
  Top 0.5: 41.05,29.34 C25.1 v41.05,31.69 C24.1 | 41.05,29.34 41.05,28.44 arc45 C26.1 | 41.05,29.34 41.01,29.34 arc45 v40.75,29.23 | R20.1 R13.1 16.65,57.85 arc-45 17.52,57.49 17.73,57.28 arc-45 18.47,55.48 OLED.3 | v114.35,19.05 112.76,19.05 arc45 RFM69HCW.9 arc-45 112.52,18.95 113.71,18.95 v116.37,18.95 | v114.35,19.05 C2.1 117.46,19.05 arc-45 C14.1 v116.37,18.95 | v116.37,18.95 114.6,18.95 arc-45 v114.35,19.05 | 115.85,34.19 v115.85,34.4
  Top 0.508: 77.27,64.94 77.22,64.89 v77.22,63.94 77.31,63.85 SJ2.2
  +3V3 0.5: v34.99,30.01 v34.99,27.81
  Bottom 0.305: 16.54,28.95 U$7.PIN4 19.34,28.95 v19.47,29.07 | 16.54,28.95 16.48,28.89 | 16.54,28.95 12.5,28.95 v10.7,27.15
  Bottom 0.406: v34.99,27.81 SJ23.2
  Bottom 0.5: SJ23.2 v34.98,30 arc-45 v34.99,30.01
  pour +3V3: -11,121.8 -11,-14.4 144,-14.4 144,121.8
+5V  (via drill 0.5)
  Top 0.305: C21.1 C3.1 arc-90 121,35.05 MCP1825.1 | RJ2.7 17.66,20.79 20.25,18.2 C47.1 | SV2.3 66.5,22.88 68.25,24.62 C10.1 68.25,35.8 | 28.8,36.12 19.75,36.12 19.25,35.62 C42.1 18.36,36.39 RJ1.7 | C47.1 20.25,17.48 21.19,16.53 22.94,16.53 28.75,22.35 28.75,23.5 v28.8,23.6 | C47.1 16.56,14.01 UART_STM.3 | 121.08,21.91 120.81,21.91 FB1.2
  Top 0.35: PCB2.P$44 24.43,73.18 arc90 C28.1 21.9,72.65 arc-90 C18.1 C27.1 | EXPANSION.26 106.24,37.56 arc-90 v106.3,37.5 | v122,33.4 arc-90 121.4,32.8 MCP1825.1 | C11.1 85.17,66.87 85.34,67.05 87.94,67.05 89.32,65.67 89.32,60.4 90.65,60.4 arc90 C7.1 91.35,60.45 arc-90 92.2,59.6 arc90 92.93,58.87 SV1.3
  Top 0.406: TP4.TP 122.19,26.48 | TP4.TP 122,26.25 arc-90 D40*1.K | TP4.TP 121.81,26.25 arc-90 121.08,26.98 | 121,28.38 MCP1825.1 | 121.08,26.98 121.08,21.91 121.08,21.41 121,21.32 arc-90 120.55,20.88 C12.2 120.55,17.44 arc90 123.09,14.9 | 121.08,26.98 121.08,28.3 | 123.09,14.9 U$2.IN+ | C15.2 arc90 123.09,14.24 123.09,14.9 | PS1.2 85.56,62.03 arc-90 84.44,63.16 84.44,66.48 C11.1
  Top 0.5: PCB2.P$42 PCB2.P$44 27.02,73.18 arc-90 28.8,71.4 28.8,36.12 v28.8,26 32.7,26 arc90 33.9,27.2 33.9,33.26 arc-90 36.44,35.8 68.25,35.8 101.91,35.8 arc45 103.7,36.54 EXPANSION.26
  Top 0.508: 121.08,28.3 121,28.38 arc90 119.49,29.88 117.19,29.88 arc-55 113.75,31.68 arc90 113.69,31.73 107.77,31.73 arc-90 105.88,33.62 arc90 103.7,35.8 101.91,35.8
  Bottom 0.35: v28.8,26 v28.8,23.6 | v122,33.4 112.84,33.4 arc-90 110.3,35.94 110.3,36.4 arc90 109.2,37.5 v106.3,37.5 arc-90 104.6,39.2 104.6,56.33 arc90 102.06,58.87 SV1.3
  Bottom 0.406: TERM2.P$6 101.59,7.76 105.02,11.2 121.8,11.2 124.16,13.56 124.16,14.74 U$2.IN+
+24V
  Top 0.3: R9.2 R11.2 arc-90 86.55,14.9 U$2.OUT+ arc90 84.15,14.55 R17.2 84.15,6.33
  Top 0.305: TERM2.P$1 84.09,6.27 arc-90 84.15,6.33
AC1  (via drill 0.5)
  Top 0.178: v122.08,54.77 121.92,54.61 121.84,54.56
  Top 0.254: VT1.PWR2 arc-90 121.95,43.25 121.95,54.12 arc28 121.84,54.56 arc62 121.02,55.05 R43.2 arc-90 120.29,54.52 SJ37.2 arc-90 119.11,54.42 Q21.3
  Bottom 0.178: v122.08,54.77 122.08,56.67 126.52,61.12 126.52,62.07 TERM3.P$2
AC1_MOS
  Top 0.254: R43.1 119.47,53.35 arc-90 SJ37.1 arc-90 117.81,52.23 Q21.2 arc-90 115.7,50.44 R53.1 113.22,51.98 arc-90 R25.1
AC2
  Top 0.254: Q22.3 119.06,64.5 arc-90 SJ36.2 121.03,63.52 arc90 R42.2 arc-90 123.16,65.64 TERM3.P$3
AC2_MOS
  Top 0.254: R26.1 113.22,60.41 arc90 R52.1 115.49,60.04 arc90 Q22.2 arc-90 118.07,62.62 SJ36.1 121.15,62.62 arc-90 R42.1
AC3
  Top 0.178: SJ35.2 120.33,71.28 121.28,71.28 121.6,71.6 R41.1
  Top 0.254: TERM3.P$4 125.69,69.14 arc-90 124.1,70.73 arc90 123.19,71.65 R41.1 | Q33.3 119.48,71.91 arc-90 SJ35.2
AC3_MOS
  Top 0.254: R41.2 120.54,69.95 arc-90 SJ35.1 arc-90 119.61,69.71 Q33.2 arc-90 117.09,68.39 114.44,68.39 arc-90 R51.1 113.79,70.3 arc-90 R27.1
ADC_2_RJ45IN  (via drill 0.5)
  Top 0.178: STM32F303VET6.61 57.4,57.4 56.98,56.98 v56.66,56.98 | v45.03,60.46 44.73,60.77 37.14,60.77 v37.09,60.82 | v13.58,15.88 13.58,18.62 RJ2.8
  Bottom 0.178: v56.66,56.98 57.12,57.44 57.12,58.6 55.26,60.46 v45.03,60.46 | v37.09,60.82 36.8,61.11 24.38,61.11 23.76,60.49 23.18,60.49 22.59,61.09 21.55,61.09 21.32,60.85 17.51,60.85 9.26,52.6 9.26,38.63 10,37.88 10,26.75 | v13.58,15.88 10,19.46
  Bottom 0.203: 10,19.46 8.32,21.14 8.32,25.07 10,26.75
ADC_RJ45IN  (via drill 0.5)
  Top 0.178: v35.38,62.12 37.25,64 53.87,64 56.96,60.9 STM32F303VET6.54 | RJ1.8 9.55,35.12 v9.26,35.41
  Bottom 0.178: v35.38,62.12 18.15,62.12 8.76,52.73 8.76,38.04 9.26,37.54 v9.26,35.41
ANT
  Top 0.813: RFM69HCW.8 111.79,16.9 arc90 109.26,14.38 J$1.SIG
BIAS  (via drill 0.5)
  Top 0.254: 56.17,64.03 arc32 55.79,65.35 | 55.79,65.35 arc20 55.21,65.99 | 55.21,65.99 arc37 53.71,66.5 | 53.71,66.5 52.13,66.5 | 52.13,66.5 v37.5,66.5 | 21.95,104.57 23.73,104.57 CT8.P$1 24.32,104.62 33.2,104.62 | 34.03,104.62 36.38,104.62 CT7.P$1 37.02,104.62 46.46,104.62 | 34.03,104.62 33.2,104.62 | 46.46,104.62 49.08,104.62 CT6.P$1 49.72,104.62 58.4,104.62 | 84,104.62 83.77,104.62 | 83.77,104.62 58.4,104.62 | 58.4,104.64 61.76,104.64 CT5.P$1 62.43,104.63 71.1,104.63 71.1,104.62 74.48,104.62 CT4.P$1 75.19,104.69 | 75.19,104.69 87.11,104.69 CT3.P$1 87.91,104.71 96.5,104.71 | 75.19,104.69 71.4,104.69 | 71.4,104.69 58.4,104.69 | 96.5,104.71 99.79,104.71 100.13,104.37 | 100.13,104.37 CT2.P$1 100.61,104.71 110.17,104.71 110.17,104.73 112.47,104.73 CT1.P$1 | 120.99,104.61 113.21,104.61 CT1.P$1 | 120.99,104.61 arc-90 122.6,103 122.6,101.45 arc-90 JP4.2 121.01,100.25 | 58.4,104.62 58.4,104.64 | 33.2,104.62 | 96.5,104.71 | VT1.GNDBREAK VT1.GND 130,60.6 | v55.91,66.58 arc-45 55.82,66.5 54.93,66.5 | 54.93,66.5 53.71,66.5 | D14.K 55.24,66.04 55.21,65.99 | 55.79,65.35 55.88,65.41 55.88,64.14 R6.1 | 66.67,90.81 CT5.P$4 arc90 64.81,92.59 60.72,92.59 | TERM3.P$1 128.04,58.64 130,60.6 | 8.7,90.85 8.7,80.94 arc90 12.16,77.48 32.02,77.48 arc-90 v32.25,77.24 | 16.77,92.17 arc-90 CT9.P$4 15.45,90.85 8.7,90.85 | 21.95,104.57 arc-90 21.95,104.57 | 20.64,104.57 11.57,104.57 CT9.P$1 9.72,104.3 arc90 8.7,103.28 8.7,90.85 | 20.64,104.57 21.95,104.57 | 22.87,92.66 arc-90 21.95,93.58 21.95,103.26 arc90 20.64,104.57 | 22.87,92.66 arc-90 23.51,92.02 RB9.2 | RB9.2 RB9Q.1 arc-90 RB9Q.1 | RB9.2 arc-90 23.54,90.67 RB9_.2 arc-90 26.25,91 CT8.P$4 arc90 26.64,92.66 22.87,92.66
  Top 0.254: 34.03,104.62 arc-90 34.68,103.97 34.68,93.33 arc90 35.48,92.53 36.09,92.53 | CT7.P$4 arc90 39.47,92.53 36.09,92.53 | 36.09,92.53 36.09,90.72 arc90 RB8.2 | RB8.2 36.1,87.65 arc90 RB8Q.1 | CT6.P$4 arc90 52.03,92.67 48.3,92.67 arc-90 47.42,93.55 | 47.42,93.55 47.42,103.66 arc90 46.46,104.62 | RB7.2 arc-90 47.42,92.05 47.42,93.55 | RB7.2 RB7Q.1 arc-90 RB7Q.1 | RB7_.2 RB7.2 arc-90 RB7.2 | RB8.2 RB8_.2 arc-90 RB8_.2 | 120.99,104.61 arc-90 122.77,102.83 122.77,100.1 arc90 125.31,97.56 127.46,97.56 arc-90 130,95.02 130,60.64 | 130,60.6 130,60.64 | CT1.P$1 112.9,102.69 arc-90 110.36,100.14 JP5.2 107.48,100.14 | JP6.2 97.68,100.19 arc90 100.13,102.64 100.13,104.37 | 58.4,104.64 arc-90 60.31,102.73 60.31,93 arc90 60.72,92.59 | RB6.2 61.49,91.81 arc90 60.72,92.59 | RB6.2 arc90 RB6.2 | RB6.2 61.56,90.69 63.9,90.69 arc-90 RB6_.2 | 71.4,104.69 arc-90 72.86,103.22 72.86,93.25 arc90 73.55,92.55 73.59,92.55 | 73.59,92.55 77.55,92.55 arc-90 CT4.P$4 arc-90 78.73,90.63 RB5_.2 RB5.2 | RB5.2 arc-90 RB5.2 74.4,91.75 arc90 73.59,92.55 | RB5Q.1 74.39,90.63 arc-90 RB5.2 | RB4.2 87.1,87.59 arc90 RB4Q.1 | RB4_.2 RB4.2 arc90 RB4.2 | RB4.2 84.9,92.72 84.7,93.94 84.7,103.68 arc90 83.77,104.62 | R53.2 110.32,50.44 arc90 v110.27,50.5 | R52.2 110.57,60.04 arc90 v110.52,59.99 | 54.93,66.5 54.93,66.99 D1.A | 130,60.64 130.02,60.64 130,60.6 | v112.08,64.61 112.08,68.9 R51.2 | TP5.1 52.17,66.54 52.13,66.5
  Top 0.305: RB6Q.1 61.49,90.62 arc-90 61.56,90.69
  Bottom 0.254: v37.5,66.5 arc90 36.2,67.8 35.1,67.8 arc-90 33.3,69.6 33.3,76.7 arc90 32.76,77.24 v32.25,77.24 arc-62 v32.25,77.25 | 109.41,56.61 arc27 109.28,57.18 arc18 109.04,57.5 94.34,72.2 arc45 93.08,72.72 63.91,72.72 arc45 60.81,71.44 v55.91,66.58 | v110.27,50.5 arc-90 109.41,51.36 109.41,56.61 | 109.41,56.61 109.41,58.88 arc-90 v110.52,59.99 110.65,60.01 112.08,61.44 v112.08,64.61
BIAS*
  Top 0.254: STM32F303VET6.51 58.25,63.61 R6.2
BIAS_IN
  Top 0.178: 54.18,58.64 R23.2 54.2,59.16 54.06,59.3 52.64,59.3 TP10.1
  Top 0.254: STM32F303VET6.58 56.88,58.9 56.42,59.37 54.2,59.37 | C50*.2 50.98,59.33 52.64,59.33 | 54.16,59.33 52.64,59.33 | TP10.1 52.64,59.3 52.64,59.33
  Top 0.305: R23.2 54.2,59.37 | 54.16,58.89 54.16,59.33 | 54.18,58.64 R22.1
BOOT0  (via drill 0.5)
  Top 0.178: R2.1 69,46.17 STM32F303VET6.94 69,49.5 68.16,50.34 v67.29,50.34 | v52.25,65 51.5,65.75 34.88,65.75 J1.1 | v68.1,43.97 v67.15,43.02
  Bottom 0.178: v52.25,65 52.63,65 v67.29,50.34 67.29,50.17 64.5,47.37 64.5,47.17 66.88,44.78 68.1,44.78 | 84.5,41 80.72,44.78 68.1,44.78 | v67.15,43.02 67.31,42.86 67.31,37.62 66.83,37.15 66.83,34.61 67.15,34.29 68.58,34.29 79.69,23.18 79.69,20.32 83.5,16.51 84.77,16.51 92.23,9.05 92.23,4.92 94.61,2.54 113.82,2.54 124.46,13.18 129.06,13.18 BOOT_STM.1 | 68.1,44.78 v68.1,43.97
BOOT0_RPI
  Top 0.178: J1.2 34.75,66.75 33,66.75 31.75,68 PCB2.P$47
BUTTON1
  Top 0.178: S1.2 5.87,77 27.25,77 30,74.25 30,62.12 31.62,60.5 PCB2.P$53 31.75,60.48 33.02,60.48 SJ3.1
  Top 0.254: S1.2
BUTTON1_STM  (via drill 0.5)
  Top 0.178: v29.37,72.87 29.37,60.96 30.8,59.53 33.66,59.53 33.97,59.85 33.97,60.48 SJ3.2 | v32.07,71.91 32.54,71.91 32.7,72.07 55.24,72.07 58.74,68.58 v59.05,68.58 | v59.69,62.23 59.37,61.91 59.37,61.75 59.05,61.44 58.26,61.44 STM32F303VET6.53
  Bottom 0.178: v29.37,72.87 31.11,72.87 v32.07,71.91 | v59.05,68.58 58.26,67.79 58.26,66.36 59.37,65.25 59.37,62.55 v59.69,62.23
CT1  (via drill 0.5)
  Top 0.254: RF1.2 116.36,87.92 arc90 117.18,87.1 arc-90 118.1,86.18 CF1.2 118.1,83.95 | 118.1,83.95 118.1,82.74 arc-90 115.56,80.2 107.37,80.2 arc90 106.09,78.93 arc-90 104.72,77.55 87.42,77.55 arc90 84.88,75.01 84.88,72.9 arc-90 82.34,70.36 v73.77,70.36 | v72,59.25 arc90 72.36,58.9 STM32F303VET6.18 | TP18.1 118.12,83.93 118.1,83.95
  Bottom 0.254: v73.77,70.36 arc-90 72.19,68.78 71.88,68.78 arc90 69.53,66.43 69.53,62.12 arc90 70.53,61.12 71.19,61.12 arc-90 72,60.3 v72,59.25
CT2
  Top 0.254: RF2.2 103.72,87.79 arc90 104.38,87.13 arc-90 105.37,86.13 CF2.2 105.37,81.31 arc-90 102.83,78.77 86.22,78.77 arc90 83.68,76.22 83.68,73.78 arc-90 81.14,71.24 72.95,71.24 arc90 70.5,68.79 STM32F303VET6.29
CT3
  Top 0.254: RF3.2 91,87.77 arc90 91.7,87.07 arc-90 92.63,86.15 CF3.2 92.63,82.9 arc-90 90.09,80.36 84.31,80.36 arc90 81.77,77.82 81.77,74.66 arc-90 79.23,72.12 72.54,72.12 arc90 70,69.58 STM32F303VET6.30
CT4
  Top 0.254: RF4.2 78.22,88.01 arc90 78.97,87.26 arc-90 79.94,86.29 CF4.2 79.94,75.64 arc-90 77.4,73.1 72.04,73.1 arc90 69.5,70.56 STM32F303VET6.31
CT5
  Top 0.254: RF5.2 65.54,87.82 arc90 66.31,87.05 arc-90 67.25,86.12 CF5.2 67.25,80.76 arc90 67.3,80.71 67.39,80.71 arc-90 69,79.11 STM32F303VET6.32
CT6
  Top 0.254: RF6.2 52.86,88.01 arc90 53.64,87.23 arc-90 54.53,86.34 CF6.2 54.53,79.71 arc90 56.69,77.55 67.89,77.55 | 68,77.55 67.89,77.55 | STM32F303VET6.33 68.5,76.94 arc90 67.89,77.55
CT7
  Top 0.254: RF7.2 40.23,87.63 arc90 40.95,86.9 arc-90 41.92,85.94 CF7.2 | CF7.2 41.92,78.64 arc90 44.46,76.1 67.04,76.1 arc-90 68.01,75.13 arc90 68,75.12 STM32F303VET6.34 | CF7.2 TP19.1
CT8
  Top 0.254: 29.23,85.91 CF8.2 | CF8.2 29.16,86.28 arc90 28.31,87.12 arc-90 27.44,87.99 RF8.2 | CF8.2 29.16,82.15 arc90 31.7,79.61 35.19,79.61 arc-90 36.11,78.69 36.11,77.63 arc90 38.65,75.09 66.69,75.09 arc-90 67.47,74.31 67.47,71.94 arc-90 67.25,71.72 arc90 66.5,70.97 STM32F303VET6.37
CT9
  Top 0.254: RF9.2 14.78,88.12 CF9.2 16.61,85.51 16.61,80.91 arc90 19.2,78.32 31.7,78.32 arc-90 35.05,74.97 35.05,74.95 arc90 36.8,73.2 55.6,73.2 arc-90 57.55,71.25 57.55,70.84 arc90 58.46,69.94 arc-90 61,67.39 STM32F303VET6.48
CT_IN1
  Top 0.254: CT1.P$2 arc90 113.92,93.67 120.39,93.67 | 120.39,93.67 D13.K D29.A arc90 D29.A | 120.39,93.67 arc-90 122.18,91.89 RB1.1 arc-90 122.16,90.83 RB1_.1 119.76,90.22 arc-90 RF1.1 arc-90 119.67,86.91 119.67,86.54 arc90 120.93,85.27 Q11_.2
CT_IN2
  Top 0.254: CT2.P$2 arc90 101.31,93.59 107.56,93.59 arc-90 107.69,93.46 | 107.69,93.46 D12.K arc90 107.5,93.48 D28.A | 107.69,93.46 109.56,91.59 RB2.1 107.98,90.66 | 107.98,90.66 107.81,90.66 arc90 107.79,90.65 arc-90 105.66,88.52 RF2.1 arc-90 107.12,86.81 107.12,86.44 arc90 Q12_.2 | RB2_.1 107.95,90.69 arc-90 107.98,90.66
CT_IN3
  Top 0.254: CT3.P$2 arc90 88.56,93.64 D11.K | D11.K 95.67,93.64 arc-90 96.75,92.57 RB3.1 arc-90 RB3.1 RB3_.1 94.34,90.11 arc-90 RF3.1 arc-90 94.29,86.88 94.29,86.4 arc90 Q13_.2 | D11.K 96.33,93.64 arc-90 D27.A
DIO0_RFM  (via drill 0.5)
  Top 0.178: v70.96,47.15 70.96,48.58 STM32F303VET6.98 | v86.52,38.1 85.57,37.15 v85.09,37.15 | v93.98,27.94 94.61,27.94 95.57,26.99 96.36,26.99 RFM69HCW.2
  Bottom 0.178: v70.96,47.15 72.23,45.88 73.98,45.88 74.14,46.04 76.52,46.04 77.31,45.24 80.8,45.24 86.52,39.53 v86.52,38.1 | v85.09,37.15 85.09,36.83 v93.98,27.94
DS18B20_RJ45  (via drill 0.5)
  Top 0.178: RJ1.4 18.95,40.2 R1.1 19.84,40.96 20.16,40.64 22.54,40.64 v23.5,41.59 | v59.69,46.2 60.96,47.47 60.96,48.58 STM32F303VET6.78 | v41.12,42.76 35.75,42.71 34.58,41.54 30.21,41.54 v30,41.75 | TP9.1 20.85,22.8 R7.1
  Top 0.203: RJ1.4 11.1,40.2 9.81,38.91 9.81,37.37 8.2,35.75 | v8.2,26.43 10.03,24.6 RJ2.4
  Top 0.254: R7.1 18.03,24.6 RJ2.4 | 8.2,35.75 v8.2,35.66
  Bottom 0.178: v59.69,46.2 58.1,46.2 57.63,45.72 55.88,45.72 54.93,44.77 53.66,44.77 53.34,44.45 53.34,43.97 52.07,42.7 v41.12,42.76 | v30,41.75 28.57,41.75 27.94,41.12 23.97,41.12 v23.5,41.59
  Bottom 0.203: v8.2,35.66 v8.2,26.43
ESP_PWR  (via drill 0.5)
  Top 0.178: R29.2 37.87,32.7 v39.51,32.7 | v52.26,41.34 52.26,43.45 54.32,45.51 58.7,45.51 59.14,45.06 60.27,45.06 61.5,46.29 STM32F303VET6.79
  Top 0.203: v40.28,37.92 43.45,41.09 v43.62,41.09
  Bottom 0.178: v39.51,32.7 39.51,37.15 | v52.26,41.34 52.01,41.09 v43.62,41.09
  Bottom 0.203: 39.51,37.15 v40.28,37.92
ESP_PWR_PRE  (via drill 0.5)
  Top 0.178: v35.88,30.48 36.04,30.32 36.99,30.32 R29.1
  Bottom 0.178: v35.88,30.48 35.88,29.05 SJ23.1
  Bottom 0.5: SJ23.1 37.73,28.83 arc-45 U1.2
EXT_TERM1  (via drill 0.5)
  Top 0.178: D17.K 18.2,60.12 v22.34,60.12 | v44.38,54.78 44.63,55.03 54.69,55.03 56.02,56.37 58.22,56.37 STM32F303VET6.63 | TERM1.P$2 6.14,64.05 8.85,66.76 C1.1
  Top 0.254: 9.63,67 arc-90 C1.1 11.55,66.76 arc-90 D17.K
  Bottom 0.178: v22.34,60.12 22.9,59.56 39.75,59.56 41.98,57.33 41.98,57.18 v44.38,54.78
EXT_TERM2  (via drill 0.5)
  Top 0.178: D18.K 10.44,60.9 C19.1 10.28,60.75 4.59,60.75 TERM1.P$3
  Top 0.203: STM32F303VET6.64 56.29,55.9 54.91,54.51 52.13,54.51 52.01,54.63 45.36,54.63 41.66,50.92 39.7,50.92 36.12,54.49 33.94,54.49 33.67,54.22 v29.75,54.22 | v27.93,53.53 27.48,53.98 27.48,56.26 27.38,56.36 19.7,56.36 15.17,60.89 D18.K
  Bottom 0.203: v29.75,54.22 28.62,54.22 v27.93,53.53
EXT_TERM3  (via drill 0.5)
  Top 0.178: TERM2.P$4 94.59,5.73 94.07,6.25 | v65.43,47.14 65.5,47.21 STM32F303VET6.87
  Top 0.5: 94.07,6.25 arc-45 95.96,10.82 C22.1 96.17,12.8 D26.K
  Bottom 0.178: TERM2.P$4 94.59,6.55 99.75,11.71 99.75,37.5 103.62,41.38 103.62,48 98.88,52.75 91.71,52.75 91.21,53.25 75.5,53.25 71.27,49.02 67.31,49.02 v65.43,47.14
GND  (via drill 0.5)  (189 unrouted)
  Top 0.203: 14.45,41.44 RJ1.3
  Top 0.254: STM32F303VET6.49 60.5,61.81 62.91,59.41 64.67,59.41 v65.49,59.41 65.92,59.41 65.92,58.58 65.92,57.53 | STM32F303VET6.74 62.11,50.9 65.18,53.97 arc45 65.92,55.77 65.92,57.53 | STM32F303VET6.99 71.52,51.15 66.68,55.98 arc-45 65.92,57.53 | Q4.1 83.96,41.33 83.96,40.53 84.06,40.53 v84.07,40.51 | C6.1 71.85,43.61 v70.61,43.98 69.71,43.92 R2.2 | C5.1 54.65,51.3 v54.77,51.3 | 16.5,38.93 RJ1.5 10.86,38.93 v10.57,38.65 | C31.2 85.04,45.08 arc45 86.84,45.82 87.7,46.68 arc45 88.27,48.05 v88.27,49.02 88.27,49.65 arc45 87.64,51.16 87.05,51.76 arc45 85.25,52.5 C32.2 | C30.2 arc-45 87.94,54.88 v87.94,56.04 C29.2 | 11.79,25.87 RJ2.3 10.76,25.87 10.65,25.75 | C40.2 arc45 18.01,44.01 RJ1.1 10.56,44.01 10.56,42.83 v10.51,42.78 10.6,42.69 10.6,41.44 14.45,41.44 | EXPANSION.2 103.43,68.04 arc45 v103.32,67.99 | EXPANSION.1 100.62,68.04 arc-45 v100.58,68.06 | 27.48,85.91 CF8.1 | 52.76,85.99 CF6.1 | 65.62,85.75 CF5.1 | EXPANSION.14 104.62,52.88 103.38,52.88 v103.34,52.84 | J$1.GND@0 106.62,5 105.38,5 v105.27,4.89 | J$1.GND@1 111.88,5 113.38,5 v113.47,4.99 | STM32F303VET6.20 77.04,59.9 arc90 77.77,60.62 v77.77,60.94 | RJ2.5 v10.68,23.33 10.65,23.36
  Top 0.3: v92.29,28.15 arc-90 92.25,28.19 R16.1 92.25,29.51 arc90 89.71,32.05 Q2.2 | v90.97,23.26 arc-90 91,23.23 R14.1 arc90 88.65,19.9 R15.1 | Q3.2 83.72,20.35 arc-90 v83.96,20.11 | EXPANSION.25 97.36,37.56 v97.36,37.58 | C10.2 70.81,25.74 arc-45 71.55,23.95 SV2.1 | 42.95,28.44 arc-45 C26.2 | 1.42,81.41 LED3.C LED2.C LED1.C | D17.A C1.2 9.76,64.95 | D18.A 11.35,59.18 C19.2 10.3,59.07
  Top 0.305: R23.1 54.2,56.36 v53.85,56.01 | C50*.1 47.95,59.16 v47.53,58.74 47.53,59.2 46.67,59.2 D23.A | C9.1 58.3,66.33 v58.3,65.3 | C8.1 72.5,70.08 arc90 v72.47,70.11 | C45.2 18.9,28.45 16.54,28.45 | C41.2 21.15,37.67 v21.69,38.2 | PCB2.P$70 24.94,40.16 arc-45 v24.82,40.21 | PCB2.P$74 24.97,35.08 arc45 v24.84,35.02 | PCB2.P$79 32.44,28.17 arc-45 v32.87,28.35 | PCB2.P$65 32.86,45.24 arc45 v32.95,45.28 | PCB2.P$60 25.62,52.86 arc-45 v24.83,52.53 | PCB2.P$49 32.1,65.56 arc45 v32.97,65.92 | PCB2.P$54 25.05,60.48 arc45 v24.85,60.39 | PCB2.P$46 24.94,70.64 arc-45 v24.86,70.67 arc45 24.18,70.95
  Top 0.35: C17.2 arc-90 79.19,65.06 80.48,66.35 C13.2 arc90 80.84,67.45 81.42,66.87 v81.57,66.87 v81.58,66.87 C11.2 | C7.2 arc-90 92.3,63.95 SV1.1 | C3.2 C21.2 118.75,37.15 v116.44,37.15 C4.1 | C3.2 118.75,35.3 D22.A | C3.2 118.7,35.4 v118.7,34.18 MCP1825.2 | MCP1825.4 118.7,28.13 v118.68,28.13 | D40*1.A 122.9,28.19 125.64,28.19 USB-C.GND2 125.64,27.78 USB-C.B1/A12 | USB-C.GND3 129.82,30.55 S2.1 | LED4.C 130.24,39.77 v130.22,39.77 | USB-C.A1/B12 125.64,19.98 USB-C.GND1 125.64,19.4 C12.1 | RFM69HCW.10 112.4,20.75 112.59,20.75 C2.2 v116.42,20.75 116.42,20.85 C14.2 | C15.1 118.81,12.9 v118.81,12.84
  Top 0.5: RFM69HCW.7 v94.4,16.9 arc45 v94.39,16.9 arc-45 94.78,15.95 v94.78,15.86 | D26.A 97.75,10.91 C22.2 | RFM69HCW.7 95.83,16.9 v94.78,15.86 | v96.78,15.6 v97.77,15.6 96.52,16.85 arc45 RFM69HCW.7 | v96.78,15.6 95.88,15.6 arc-45 v95.76,15.65 | v95.76,15.65 95.28,15.65 arc-45 v94.78,15.86 | v95.76,15.65 arc-45 96.19,16.69 RFM69HCW.7 | v96.78,15.6 arc-45 96.4,16.52 RFM69HCW.7 | v114.41,20.33 arc45 113.39,20.75 112.95,20.75 | v115.15,21.9 arc-45 115.4,22 v116.25,22 115.69,21.44 arc45 C2.2 arc-45 115.15,21.35 v115.15,21.9 | v115.15,21.9 114.75,21.49 arc-45 112.95,20.75 | 112.95,20.75 112.59,20.75 | C24.2 C25.2 42.95,28.44 arc-45 C26.2 | C24.2 arc-45 43.74,33.23 v44.52,33.23 | C24.2 44.06,34.01 arc45 v44.28,34.54 | C46.2 21.92,18.7 v21.93,19.22 C47.2 | C27.2 C18.2 arc-45 22.04,70.95 v23.08,70.95 C28.2 24.18,70.95 arc-45 24.94,70.64 | v24.86,70.67 26.07,70.67 arc-45 PCB2.P$46 | 65.92,58.58 v65.27,58.47 64.67,59.41 | v77.77,60.94 77.55,60.72 v77.55,59.95
  Bottom 0.254: J$1.GND@0 106.62,5 105.38,5 v105.27,4.89 | J$1.GND@1 111.88,5 113.38,5 v113.47,4.99 | G1.- 77.62,34.12 82.88,34.12 84.5,32.5 U$2.P$1 | U1.39 45.75,34.38 v45.7,34.49
  Bottom 0.5: U1.38 53.91,27.51 arc-45 52.11,28.25 U1.39 46,35.65 arc-45 51.6,37.97 52.12,37.97 53.7,36.4 U1.31 | U1.15 40.22,44.6 40.22,42.51 arc45 40.7,41.35 v45.12,36.93 | U1.1 39.08,27.51 arc45 42.27,28.83 45.83,32.39 v45.83,33.21
  other vias: 105.36,3.75 105.23,5.92 105.27,6.98 106.14,7.69 107.28,7.67 110.99,7.72 112.21,7.69 113.48,7.27 113.49,6.06 113.48,3.77 47.08,34.15 43.68,36.97 46.93,36.95 49.53,39.62 36.96,47.12 71.37,54.48 61.93,29.2 27.76,41.85 21,57.35 10.94,64.05 11.31,57.88 90.56,64.13 76.62,59.84 86.33,65.6 85.34,64.63 81.19,65.98 7.03,17.3 23.59,21.86 22.28,37.28 98.8,12.28 119.89,96.06 106.36,95.83 93.84,95.89 82.27,99.1 70.09,98.83 57.75,98.27 44.74,97.89 31.95,98.27 19.33,98.16 66.12,58.77 8.52,59.07 7.68,51.66 10.52,50.93 10.56,25.74 19.74,46.92 31.92,28.36 26.43,34.2 27.3,40.12 30.48,45.16 24.81,53.42 27.34,60.26 32.97,65.07 27.36,70.59 13.72,85.59 26.53,84.92 39.15,84.64 51.88,85.1 64.44,84.99 77.34,85.1 89.97,84.92 102.56,84.81 115.57,84.88 111.72,73.65 110.35,65.14 110.39,56.45 100.26,57.82 117.17,37.95 115.56,37.97 112.79,37.88 119.56,25.1 118.5,25.06 117.31,25.06 130.38,26.84 129.28,26.76 129.07,20.9 130.21,20.9 129.49,32.07 90.07,32.73 75.78,33.95 89.4,20.89 109.79,21.36 109.67,20.08 108.91,20.82 10.65,35.88 22,35.33 0.9,84.07 20.29,33.14
  pour GND: -27.86,125.67 -27.86,-23.77 172.7,-23.77 172.7,125.67
  pour Top (isolate 0.35): -11.68,120.27 148.34,120.27 148.34,-7.87 -11.68,-7.87
  pour Bottom (isolate 0.406): 144.65,115.57 -15.37,115.57 -15.37,-12.57 144.65,-12.57
HSE_IN
  Top 0.178: HSE.1 79.18,54.81 78.07,55.92 73.77,55.92 STM32F303VET6.12
  Top 0.203: C30.1 85.61,55.5 arc-45 85.48,55.82 81.81,55.82 arc45 80.02,55.08
  Top 0.254: 80.02,55.08 HSE.1
HSE_OUT
  Top 0.203: R21.1 75.47,56.4 STM32F303VET6.13
HSE_OUT_
  Top 0.203: HSE.3 83.17,56.23 78.47,56.23 R21.2
  Top 0.3: HSE.3 85.95,57.21 arc-45 C29.1
HSPI_CLK  (via drill 0.5)
  Top 0.178: v33.53,35.64 33.05,35.15 v33.05,31.26
  Bottom 0.178: U1.13 37.75,42.62 37.62,42.5 36.18,42.47 SJ10.1 35.77,43.03 35.52,43.27 32.64,43.27 32.02,42.66 32.02,42.37 34.05,40.34 34.05,39.52 33.53,39 v33.53,35.64 | v33.05,31.26 31.61,31.26 JP8.3
HSPI_CS0  (via drill 0.5)
  Top 0.178: v49.63,46.75 49.13,46.25 49.13,42.2 47.89,40.96 47.89,38.88 49.89,36.88 v50.91,36.88 | v50.18,31.89 47.81,29.52 47.81,28.71 v47.76,28.71 | v34.15,23.45 32.17,23.45 31.86,23.77 31.67,23.77 v30.96,23.06
  Bottom 0.178: U1.23 50.88,45.12 50.88,46.88 SJ13.1 50.52,46.78 49.69,46.78 49.66,46.75 v49.63,46.75 | v50.91,36.88 50.18,36.15 v50.18,31.89 | v47.76,28.71 45.55,28.71 43.45,26.6 37.04,26.6 34.12,23.69 34.12,23.48 v34.15,23.45 | v30.96,23.06 JP2.3
HSPI_ID/MOSI  (via drill 0.5)
  Top 0.178: v29.75,28.61 29.75,33.52 v29.71,33.56 | v33.43,40 33.68,39.75 39.6,39.75 42.99,43.14 42.99,46.82 v43.01,46.84
  Bottom 0.178: 42,46.88 42,45.12 U1.16 | 42,46.88 SJ9.1 | JP3.3 28.91,27.77 v29.75,28.61 | v29.71,33.56 29.71,35.61 32.05,37.95 32.05,38.62 v33.43,40 | v43.01,46.84 42.04,46.84 42,46.88
HSPI_Q/MISO
  Bottom 0.178: 36.57,44.12 37.75,44.12 U1.14 | 36.57,44.12 35.88,44.12 35.88,43.85 35.66,43.64 32.38,43.64 31.6,42.87 31.6,38.1 29.35,35.85 | 36.57,44.12 SJ4.1
  Bottom 0.203: JP7.3 28.43,34.93 29.25,34.93 29.35,35.03 29.35,35.85
LED1_GREEN  (via drill 0.5)
  Top 0.178: R3.2 7.47,88.53 v7.47,87.15 7.46,87 3.81,87 2.38,85.57 2.38,80.49 0.64,78.74 0.64,73.03 4.92,68.74 15.56,68.74 v21.43,62.87 | v40.62,62.75 43.86,62.75 46.15,60.46 50.79,60.46 51.33,61 55.62,61 56.23,60.39 STM32F303VET6.55
  Bottom 0.178: v40.62,62.75 21.63,62.75 21.59,62.71 v21.43,62.87
LED2_YELLOW  (via drill 0.5)
  Top 0.178: v7.9,84.17 7.11,84.96 7.11,85.11 R4.2 | v60.01,61.03 60.05,60.93 59.03,59.9 STM32F303VET6.56
  Bottom 0.178: v7.9,84.17 7.94,84.14 8.41,84.14 10.95,81.6 29.84,81.6 35.4,76.04 35.38,76 35.38,69.75 36.3,68.82 52.7,68.82 53.96,67.55 53.96,66.75 59.68,61.03 v60.01,61.03
LED3_RED  (via drill 0.5)
  Top 0.178: v7.73,80.36 6.98,81.11 6.98,81.49 R5.2 | v60.19,59.21 60.01,59.39 STM32F303VET6.57
  Bottom 0.178: v60.19,59.21 60.19,59.68 53.88,66 51.88,66 51.62,65.75 35.56,65.75 24.02,77.29 10.22,77.29 arc-90 7.73,79.78 v7.73,80.36
MBUS_I/O  (via drill 0.5)
  Top 0.254: 84.03,1.62 85.05,1.62 arc90 87.59,4.17 TERM2.P$2 arc-90 86.9,5.72 86.9,9.03
  Top 0.3: R17.1 arc-90 86.9,9.03 | Q1.2 arc90 82.09,23.91 v82.09,23.7 | v81.57,21.3 81.57,4.08 arc90 84.03,1.62
  Bottom 0.3: v82.09,23.7 arc90 81.57,23.19 v81.57,21.3
MOS1  (via drill 0.5)
  Top 0.178: STM32F303VET6.38 66,73.49 v66.43,73.49
  Top 0.203: v123.9,83.71 123.9,84.68 arc90 Q11_.1
  Top 0.254: v123.9,83.71 124.15,83.46 TP17.1
  Bottom 0.178: v66.43,73.49 66.43,76.61
  Bottom 0.203: 66.43,76.61 arc-90 69.55,79.73 121.36,79.73 arc90 123.9,82.27 v123.9,83.71
MOS2  (via drill 0.5)
  Top 0.178: STM32F303VET6.39 65.5,74.03 arc-90 65.55,74.08 v65.55,74.25
  Top 0.203: v111.08,83.28 111.08,84.38 arc90 Q12_.1
  Bottom 0.178: v65.55,74.25 65.55,78.19
  Bottom 0.203: 68.55,80.73 108.54,80.73 arc90 111.08,83.27 v111.08,83.28
  Bottom 0.254: 65.55,78.19 arc-90 68.09,80.73 68.55,80.73
MOS3  (via drill 0.5)
  Top 0.178: v64.42,74.13 65,73.56 STM32F303VET6.40
  Top 0.203: v98.38,83.32 98.38,84.2 arc90 Q13_.1
  Bottom 0.178: v64.42,74.13 64.42,78.71
  Bottom 0.203: 64.42,78.71 arc-90 67.55,81.83 96.89,81.83 arc90 v98.38,83.32
MOS4  (via drill 0.5)
  Top 0.178: STM32F303VET6.41 64.5,72.53 62.71,74.32 v62.59,74.2
  Top 0.203: v85.89,83.62 85.89,84.59 arc90 Q14_.1
  Bottom 0.178: v62.59,74.2 62.59,79.03
  Bottom 0.203: 62.59,79.03 arc-90 66.24,82.68 84.96,82.68 arc90 v85.89,83.62
MOS5  (via drill 0.5)
  Top 0.178: STM32F303VET6.42 64,70.93 arc90 61.43,73.5 v61.19,73.5
  Top 0.203: v73.28,83.62 73.28,84.37 arc90 Q15_.1
  Bottom 0.178: v61.19,73.5 61.19,80.22
  Bottom 0.203: 61.19,80.22 arc-90 64.58,83.62 v73.28,83.62
MOS6  (via drill 0.5)
  Top 0.178: STM32F303VET6.43 63.5,69.09 arc90 60.03,72.56
  Top 0.203: Q16_.1 59.67,84.26 arc90 v60.36,83.57
  Top 0.254: 60.03,72.56 59.76,72.56 v59.75,72.54
  Bottom 0.178: v60.36,83.57 59.83,83.04 59.83,72.64 59.75,72.56 arc90 v59.75,72.54
MOS7  (via drill 0.5)
  Top 0.178: STM32F303VET6.44 63,68.13 arc90 59.52,71.61 v58.97,71.61
  Top 0.203: v47.66,83.15 47.66,84.09 arc90 Q17_.1
  Bottom 0.178: v58.97,71.61 50.35,71.61
  Bottom 0.203: 50.35,71.61 arc-90 47.66,74.3 v47.66,83.15
MOS8  (via drill 0.5)
  Top 0.178: v41.27,77.63 34.13,84.77 Q18_.1 | v49.21,69.69 56.67,69.69 v58.9,67.47 | v61.91,62.71 62.55,63.34 62.55,64.14 STM32F303VET6.45
  Bottom 0.178: v49.21,69.69 v41.27,77.63 | v58.9,67.47 61.91,64.45 v61.91,62.71
MOS9
  Top 0.178: STM32F303VET6.46 62,68.16 arc90 59.6,70.56 59.11,70.56 arc-90 58.04,71.63 58.04,72.12 arc90 56.01,74.15
  Top 0.254: Q19_.1 21.67,81.56 arc90 24.21,79.02 32.71,79.02 arc-90 35.57,76.16 arc90 37.57,74.15 56.01,74.15
N$1
  Top 0.35: SJ1.1 93.56,66.14 arc-90 95.8,63.9 95.8,63.61 arc-90 SV1.2
N$2
  Top 0.254: CT9.P$2 arc90 11.98,94.02 D5.K 19.88,94.02 | 19.88,94.02 D15.A arc-90 D15.A | 19.88,94.02 arc-90 20.71,93.18 RB9.1 arc90 20.68,90.67 RB9_.1 18.3,87.66 | Q19_.2 arc-90 18.3,86.14 18.3,87.66 | RF9.1 17.7,88.26 arc-90 18.3,87.66
N$5
  Top 0.178: R4.1 5.23,85.24 3.61,85.24 LED2.A
N$6
  Top 0.178: LED3.A R5.1
N$7
  Top 0.305: USB-C.A4/B9 124.89,21.51 122.75,21.51 arc-90 FB1.1 arc90 123.31,22.72 123.31,25.59 arc-90 123.97,26.25 USB-C.B4/A9
N$8
  Top 0.254: CT8.P$2 arc90 24.83,93.87 D6.K 32.43,93.87 | 32.43,93.87 33.39,93.87 arc90 D16.A | 32.43,93.87 arc-90 33.3,93.01 RB8.1 arc-90 RB8.1 31.47,90.7 | RB8_.1 31.47,90.7 | RF8.1 29.16,88.39 | 29.16,88.39 arc90 31.47,90.7 | Q18_.2 arc-90 30.9,86.11 30.9,86.67 arc90 29.18,88.39 29.16,88.39
N$9
  Top 0.178: R10.1 126.34,38.38 128.03,38.38 LED4.A
N$10
  Top 0.178: 45.62,90.25 RB7.1
  Top 0.254: D7.K arc-90 44.85,93.96 D19.A | CT7.P$2 arc90 37.49,93.91 D7.K | D7.K arc-90 46.12,92.57 46.12,90.63 | 46.12,90.63 RB7.1 | RB7_.1 44.46,90.54 | 44.46,90.54 46.04,90.54 arc90 46.12,90.63 | 44.46,90.54 arc-90 42.07,88.15 RF7.1 RF7.1 arc-90 43.67,86.41 43.67,86.18 arc90 Q17_.2
N$11
  Top 0.178: SJ14.1 | SJ14.1 PCB2.P$64
N$12
  Top 0.305: R22.2 53.98,61.68 50,61.68 JP1.2
N$14
  Top 0.3: SV2.6 58.85,25.83 arc-45 C16.1
N$15  (via drill 0.5)
  Top 0.178: v39.5,28.38 40.5,27.38 43.5,27.38 43.75,27.62 58.88,27.62 C16.2
  Bottom 0.178: v39.5,28.38 39.5,29 38.5,30 37.88,30 U1.3
N$16
  Top 0.178: Q4.2 81.75,41.62 80,41.62 R8.1
N$17  (via drill 0.5)